# EasyEDA Pro project RCKid.epro, board Devboard
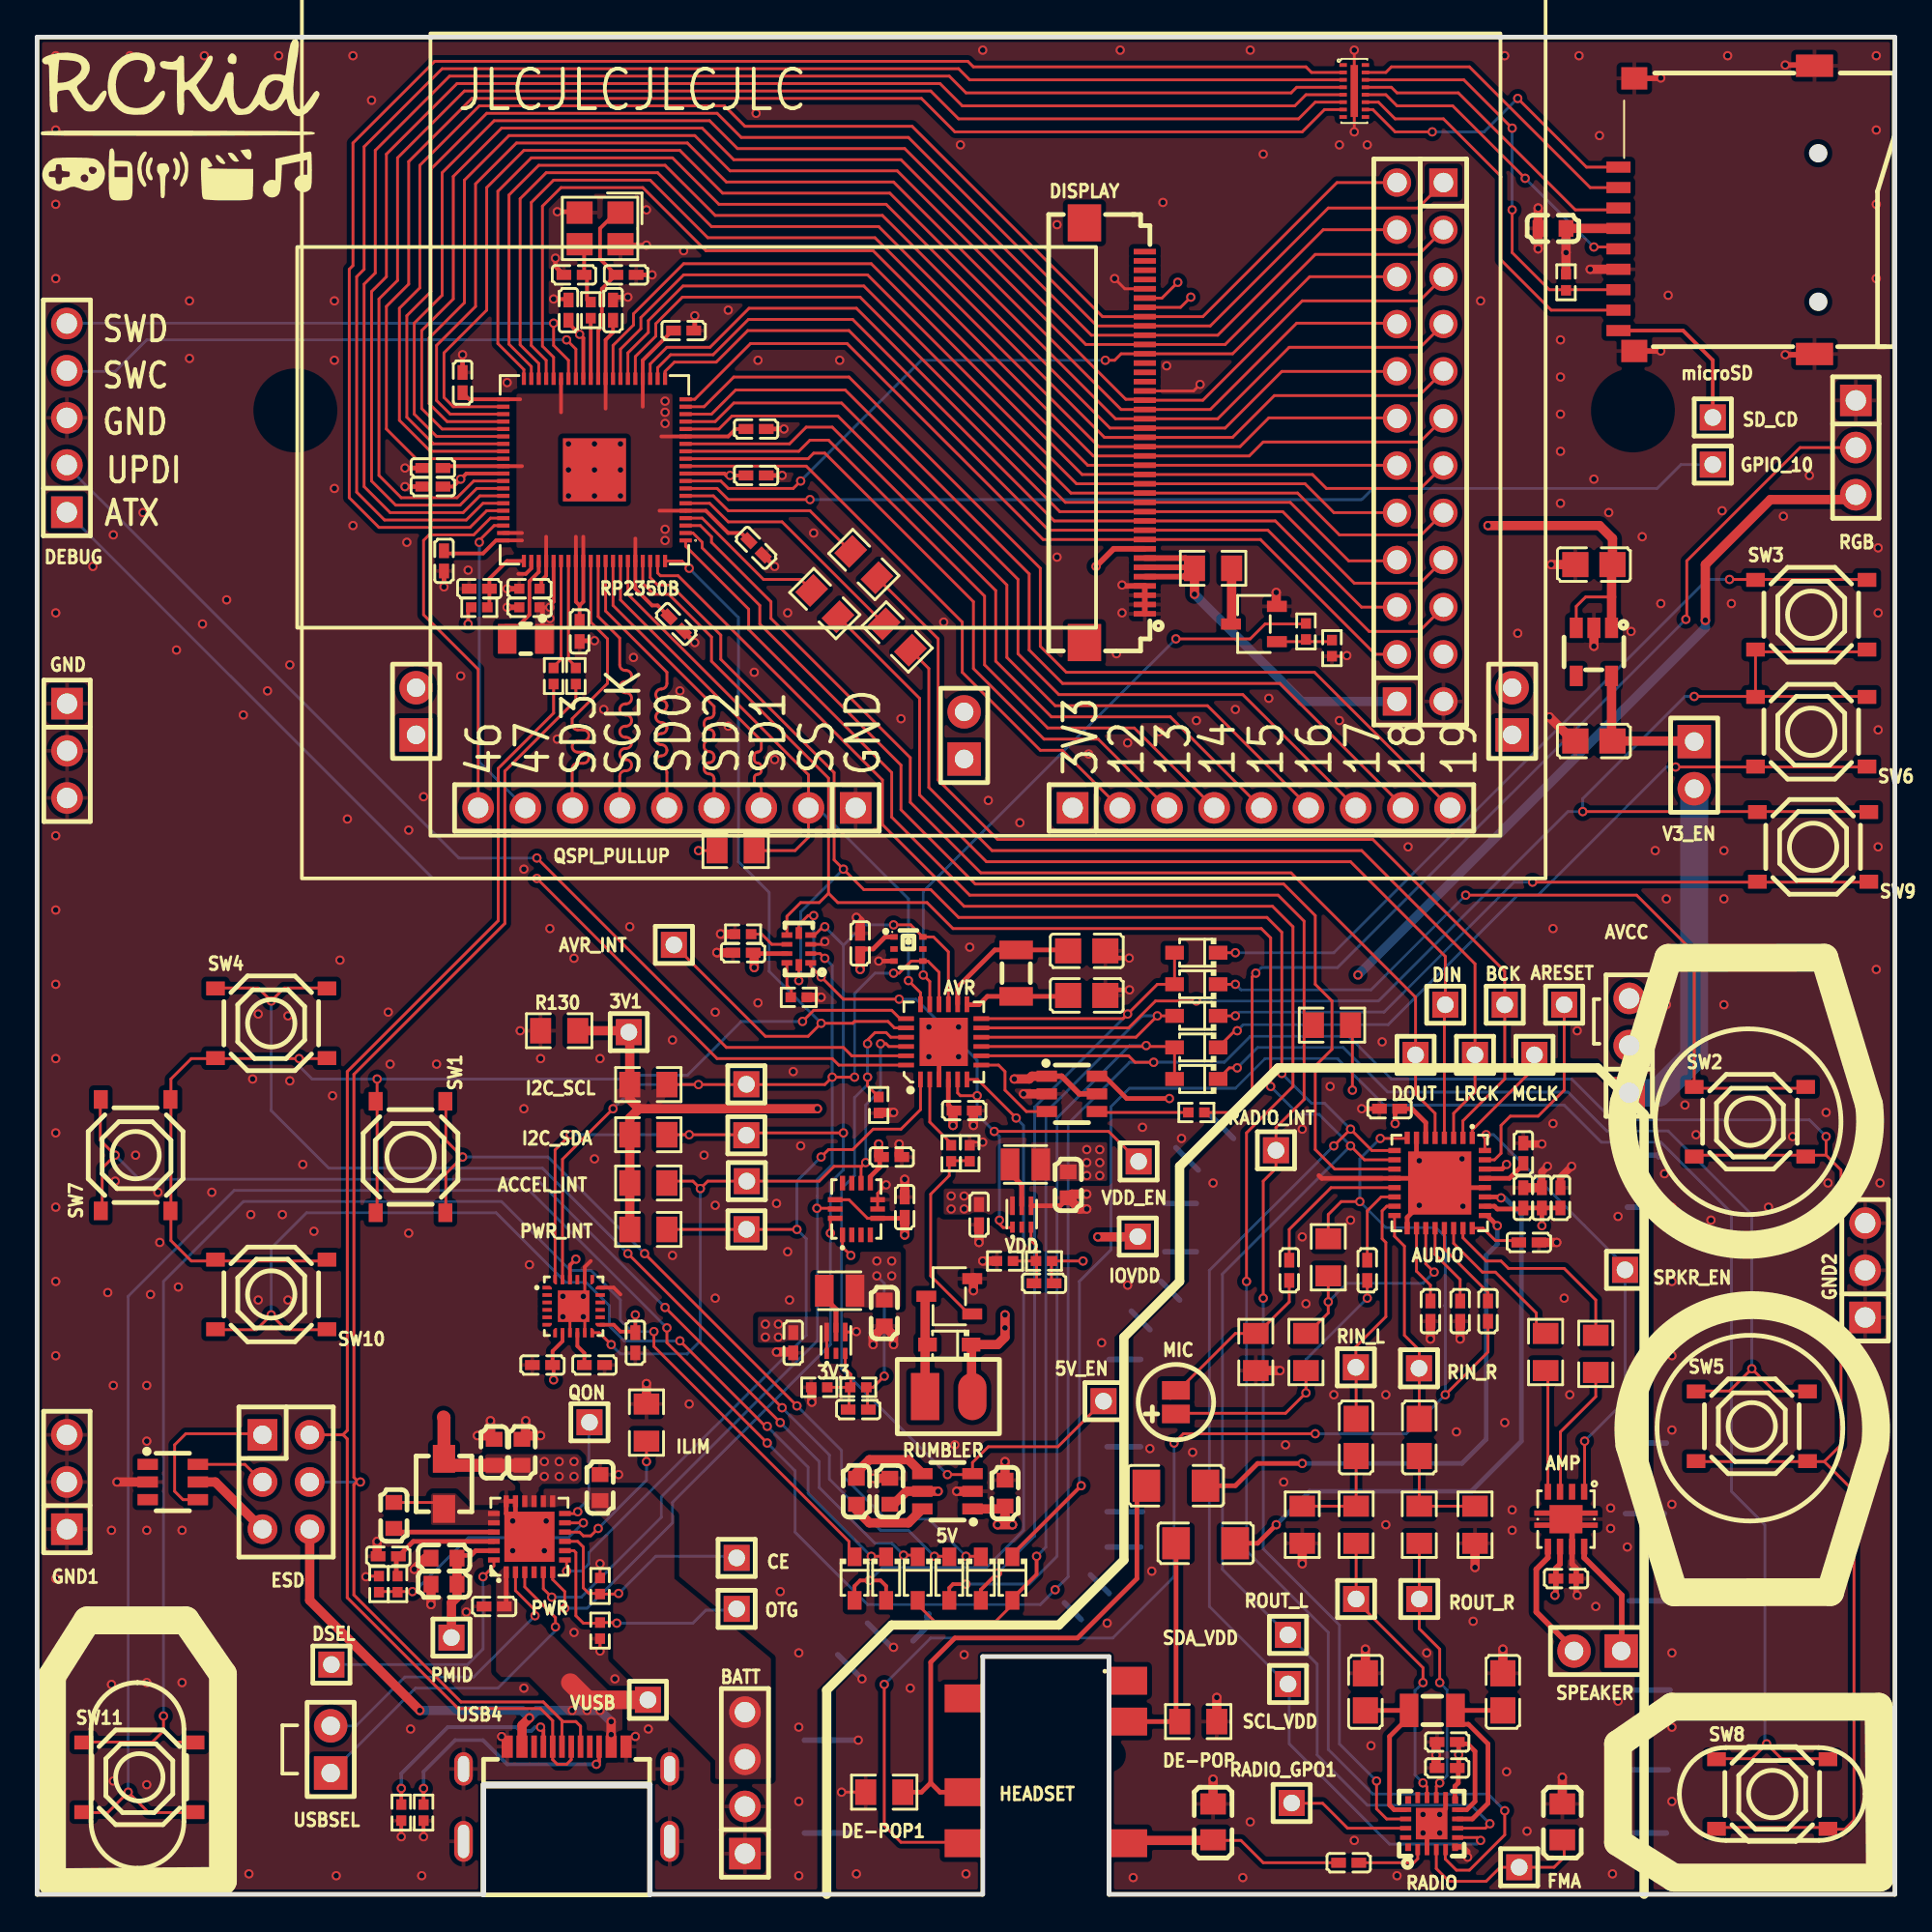
[diagram p23: board, top side]
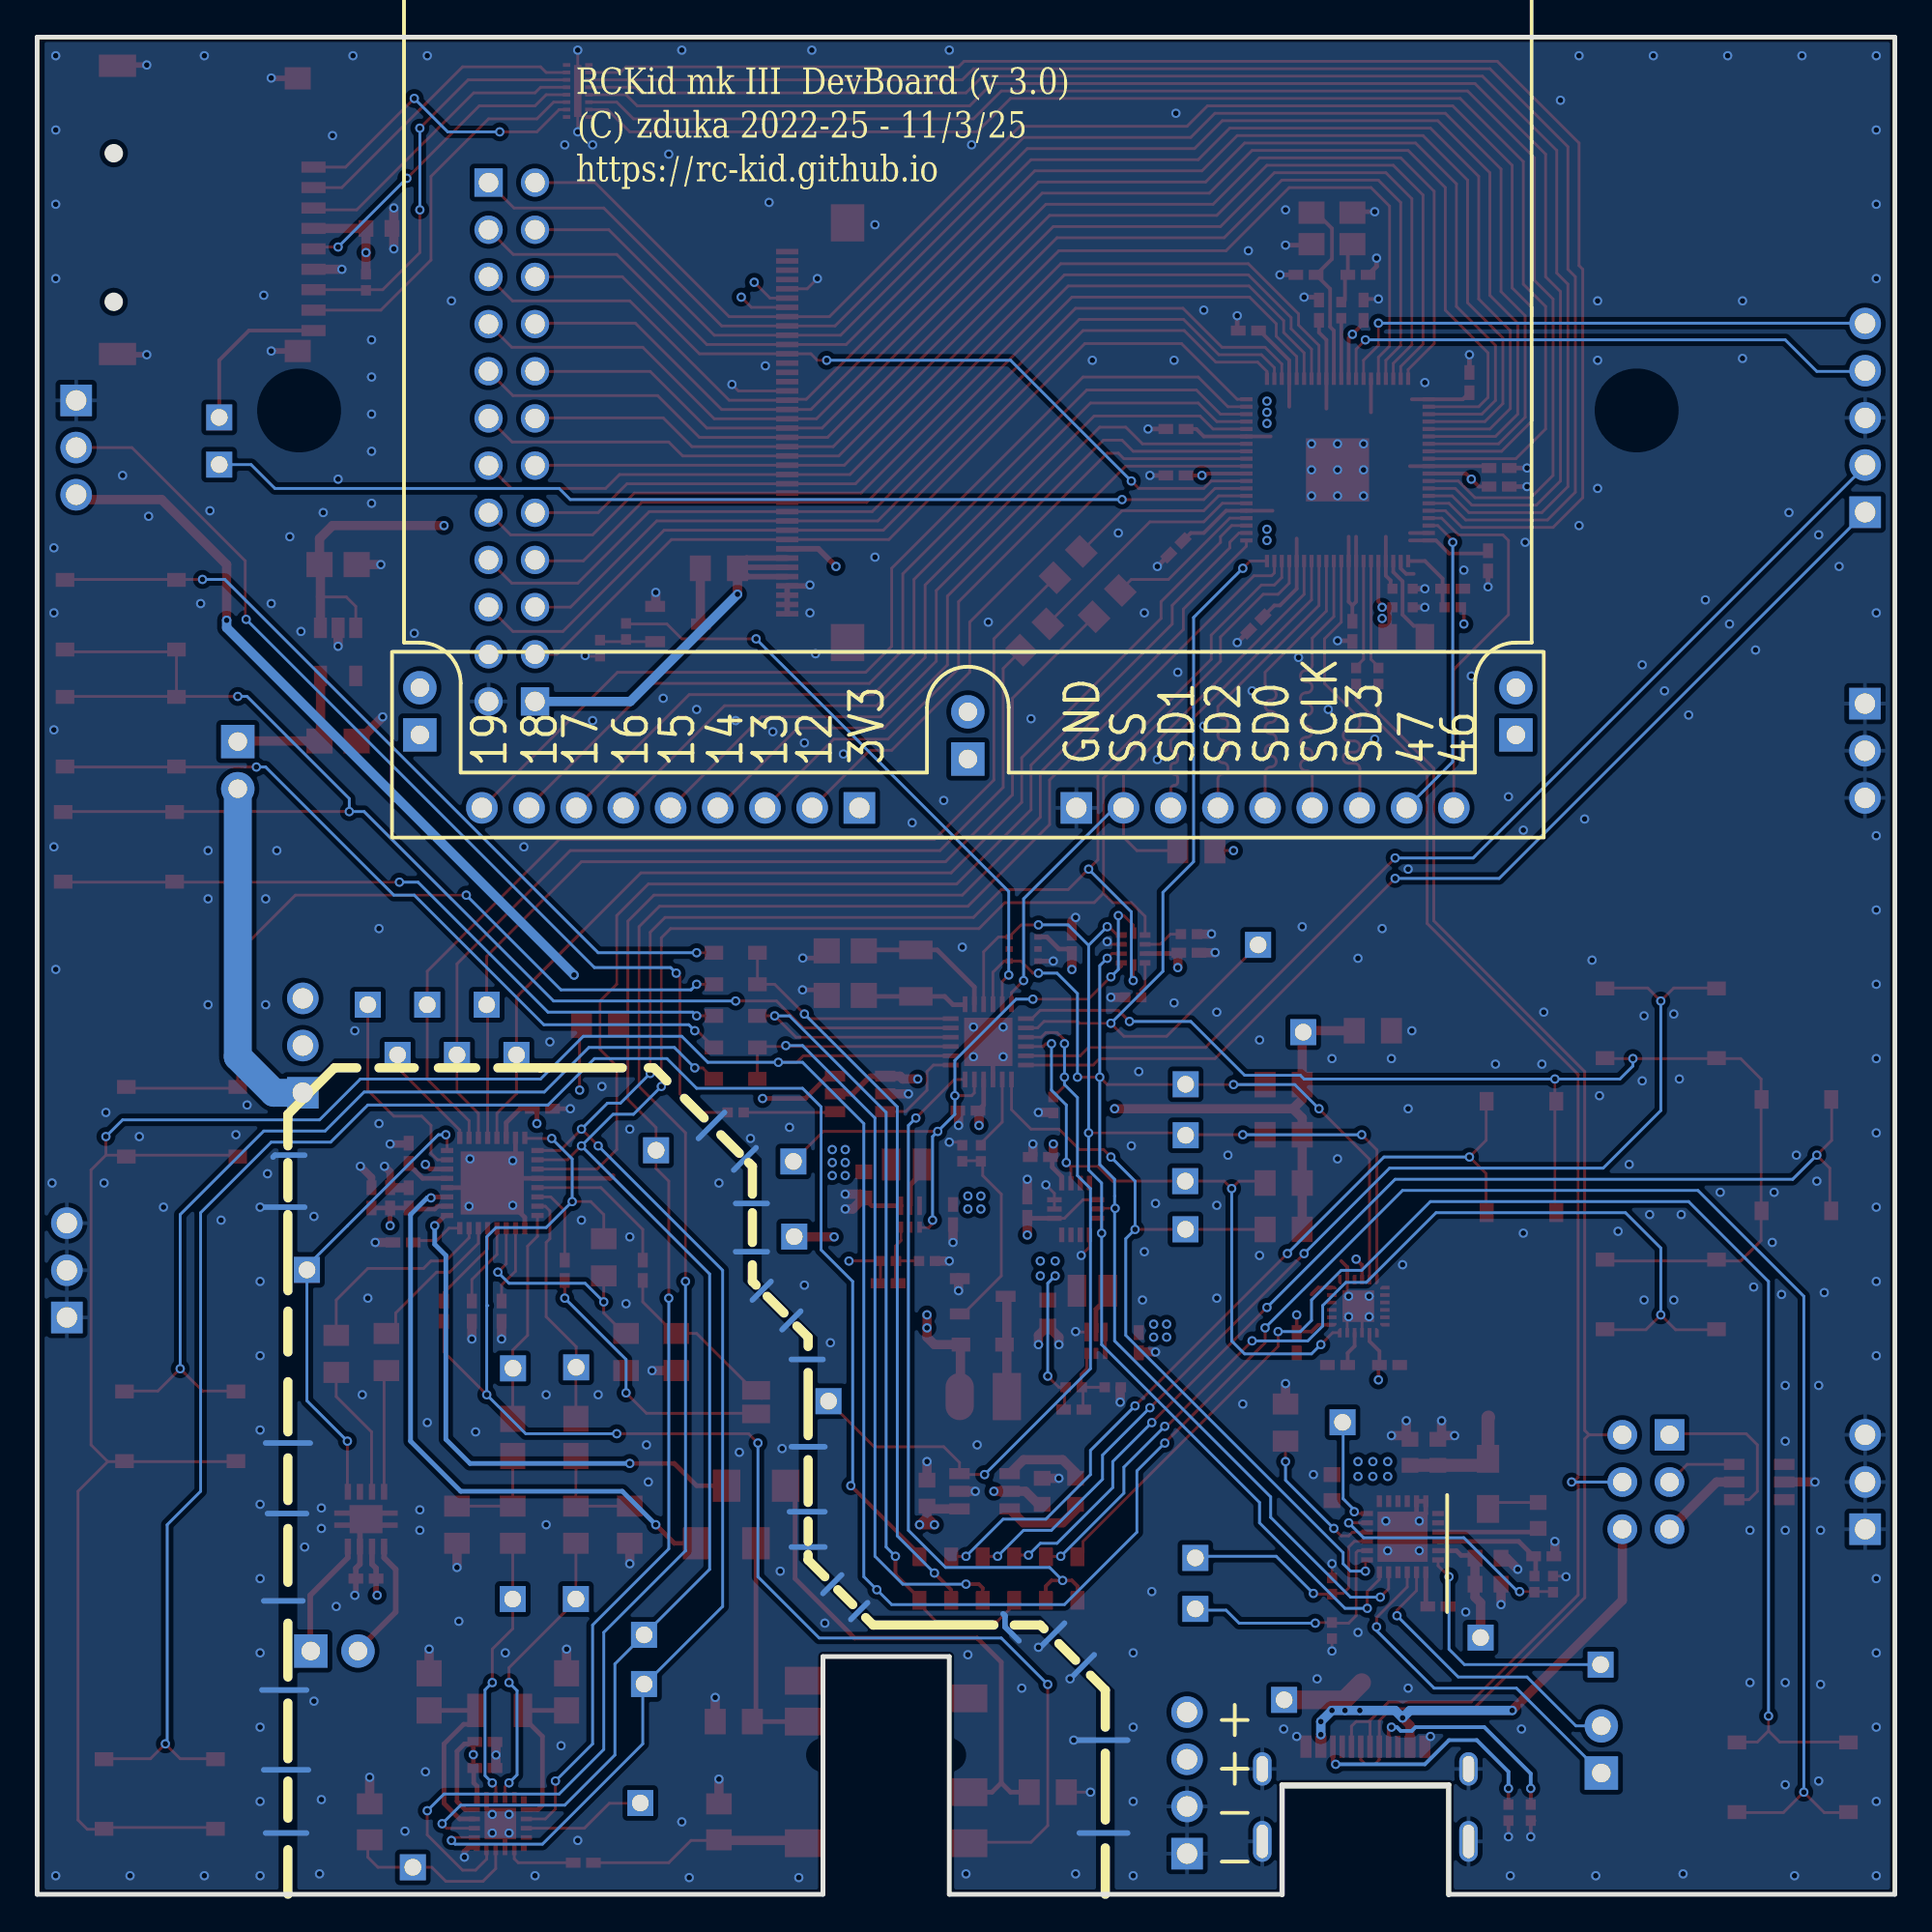
[diagram p24: board, bottom side, seen from below]

Outline 100 x 100.03 mm; copper layers: Top Layer, Inner1, Inner2, Bottom Layer. Coordinates in mm from the lower left corner of the outline.
Outline path: 0,100.03 0,0.03 24,0.03 24,5.93 33,5.93 33,0.03 50.9,0.03 50.9,12.83 57.7,12.83 57.7,0.03 100,0.03 100,100.03 0,100.03
Stack: Top Layer 0.035mm / Dielectric1 0.28mm PP er 4.5 / Inner1 0.035mm / Dielectric2 0.28mm FR4 er 4.5 / Inner2 0.035mm / Dielectric3 0.28mm PP er 4.5 / Bottom Layer 0.035mm

## Design rules (mm)
net USB_DM: DP1
net USB_DP: DP1
template: Custom Config
spacing copperThickness1oz (default): track to track 0.102, other pairs 0.152 to 0.3
spacing copperThickness2oz: track to track 0.203, other pairs 0.152 to 0.3
track width copperThickness1oz (default): min 0.127, default 0.254, max 2.54
track width copperThickness2oz: min 0.203, default 0.254, max 2.54
differential pair differentialPair (default): width min 0.156, default 0.156, max 0.156; gap min 0.2, default 0.2
via viaSize (default): diameter min 0.5, default 0.61, max 10; hole min 0.3, default 0.305, max 6.3
net 3V3 uses copperRegion1
net VUSB uses copperRegion1
net 5V uses copperRegion1
net VCC uses copperRegion1
net DVDD uses copperRegion1
net $1N63472 uses copperRegion1
net VBATT uses copperRegion1
pour e832 uses copperRegion1

## Placement (name value [footprint] x y rotation side)
3V1  -  [HDR-TH_1P-V-M_XKB_X4611WV-01I-C28D40]  31.85 46.45 0 top
3V3  TPS62825DMQT  [VSON-6_L1.5-W1.5-P0.50-TL]  43 29.73 90 top
5V  HX4002-MFC  [SOT-23-6_L2.9-W1.6-P0.95-LS2.8-BR]  49 21.73 0 top
5V_EN  -  [HDR-TH_1P-V-M_XKB_X4611WV-01I-C28D40]  57.4 26.58 0 top
ACCEL_INT  -  [HDR-TH_1P-V-M_XKB_X4611WV-01I-C28D40]  38.2 38.43 0 top
AMP  TPA2006D1DRBR  [VSON-8_L3.0-W3.0-P0.65-TL-EP]  82.3 20.23 270 top
ARESET  -  [HDR-TH_1P-V-M_XKB_X4611WV-01I-C28D40]  82.2 47.93 0 top
AUDIO  TLV320AIC3204IRHBR  [QFN-32_L5.0-W5.0-P0.50-TL-EP3.4]  75.5 38.33 270 top
AVCC  -  [HDR-TH_3P-P2.54-V-M]  85.7 45.73 90 top
AVR  ATTINY3217-MFR  [WQFN-24_L4.0-W4.0-P0.50-TL-EP2.6]  48.8 45.93 90 top
AVR_INT  -  [HDR-TH_1P-V-M_XKB_X4611WV-01I-C28D40]  34.28 51.15 0 top
BATT  -  [HDR-TH_4P-P2.54-V-M]  38.1 6.03 90 top
BCK  -  [HDR-TH_1P-V-M_XKB_X4611WV-01I-C28D40]  79 47.93 0 top
C81  10uF  [C0603]  45.9 21.73 270 top
C82  10uF  [C0603]  52.1 21.63 270 top
C83  2.2uF  [C0603]  44.1 21.73 270 top
C95  100nF  [C0402#2]  46.7 37.03 270 top
C96  100nF  [C0402#2]  46 39.73 180 top
C107  100nF  [C0402#2]  38.7 72.53 135 top
C108  100nF  [C0402#2]  34.4 68.43 135 top
C109  100nF  [C0402#2]  34.8 84.23 180 top
C110  100nF  [C0402#2]  21.3 76.83 0 top
C111  100nF  [C0402#2]  22.9 81.43 270 top
C112  100nF  [C0402#2]  38.7 78.93 180 top
C114  100nF  [C0402#2]  21.3 75.83 0 top
C115  1uF  [C0402#2]  38.7 76.43 180 top
C116  1uF  [C0402#2]  21.9 71.83 90 top
C117  100nF  [C0402#2]  31 85.33 270 top
C118  100nF  [C0402#2]  49.9 42.23 180 top
C132  22uF  [C0603]  81.6 89.73 0 top
C153  15pF  [C0402#2]  31.7 87.23 0 top
C154  15pF  [C0402#2]  28.9 87.23 180 top
C167  100nF  [C0402#2]  29.2 68.03 90 top
C191  100nF  [C0402#2]  80 37.53 270 top
C192  1uF  [C0402#2]  81 37.53 270 top
C199  47uF  [C1206]  61.3 22.03 0 top
C200  47uF  [C1206]  62.9 18.93 0 top
C201  10uF  [C0402#2]  75 31.43 270 top
C202  10uF  [C0402#2]  80.3 35.13 0 top
C203  10uF  [C0402#2]  80 39.93 90 top
C204  10uF  [C0402#2]  82 37.53 90 top
C205  100nF  [C0402#2]  71.6 33.63 270 top
C206  100nF  [C0402#2]  67.4 33.63 270 top
C207  100nF  [C0402#2]  78.1 31.43 270 top
C208  1uF  [C0402#2]  82.3 17.03 180 top
C209  1uF  [C0402#2]  72.8 42.33 0 top
C210  4.7uF  [C0402#2]  28.6 85.33 270 top
C211  4.7uF  [C0402]  26.5 70.33 0 top
C212  4.7uF  [C0402]  26.5 69.33 0 top
C213  4.7uF  [C0402#2]  23.8 70.33 0 top
C214  4.7uF  [C0402#2]  18.9 18.23 0 top
C215  22uF  [C0603]  21.9 18.13 0 top
C216  22uF  [C0603]  21.9 16.73 0 top
C218  1uF  [C0402#2]  24.6 15.53 0 top
C219  10uF  [C0603]  24.6 23.83 270 top
C220  10uF  [C0603]  26.1 23.83 270 top
C221  10uF  [C0603]  30.3 21.93 270 top
C224  4.7uF  [C0402#2]  40.7 29.73 90 top
C225  4.7uF  [C0402#2]  50.7 36.63 90 top
C228  22uF  [C0603]  45.6 31.33 90 top
C229  22uF  [C0603]  55.5 38.23 90 top
C230  120pF  [C0402#2]  44.2 26.13 0 top
C231  120pF  [C0402#2]  54.2 32.93 0 top
C232  22pF  [C0805]  56.5 48.43 180 top
C233  22pF  [C0805]  56.5 50.83 180 top
C234  100nF  [C0402#2]  38 50.73 0 top
C235  100nF  [C0402#2]  44.3 51.23 270 top
C236  22nF  [C0402#2]  75.9 6.83 0 top
C237  100nF  [C0402#2]  75.9 8.23 180 top
C238  22pF  [C0805]  78.9 10.93 90 top
C239  22pF  [C0805]  71.5 10.93 270 top
C240  470nF  [C0805]  71 24.63 90 top
C241  470nF  [C0805]  74.4 24.63 90 top
C242  100pF  [C0402#2]  70.6 1.73 0 top
C243  47nF  [C0603]  19.2 20.43 90 top
C244  100nF  [C0402#2]  76.6 31.43 90 top
C245  1uF  [C0805]  83.8 71.63 0 top
C246  1uF  [C0805]  83.8 62.13 0 top
C247  100nF  [C0402#2]  32.2 29.73 90 top
C248  100nF  [C0402#2]  30 28.53 180 top
C249  10nF  [C0402#2]  27.2 28.53 0 top
CE  -  [HDR-TH_1P-V-M_XKB_X4611WV-01I-C28D40]  37.65 18.14 0 top
D4  1N5819WS  [SOD-323_L1.8-W1.3-LS2.5-RD]  49.1 29.63 180 top
D5  1N5819WS  [SOD-323_L1.8-W1.3-LS2.5-RD]  50.8 17.03 270 top
D6  1N5819WS  [SOD-323_L1.8-W1.3-LS2.5-RD]  49.1 17.03 270 top
D7  1N5819WS  [SOD-323_L1.8-W1.3-LS2.5-RD]  47.4 17.03 270 top
D8  1N5819WS  [SOD-323_L1.8-W1.3-LS2.5-RD]  45.7 17.03 270 top
D9  1N5819WS  [SOD-323_L1.8-W1.3-LS2.5-RD]  62.4 49.03 180 top
D10  1N5819WS  [SOD-323_L1.8-W1.3-LS2.5-RD]  62.4 43.93 180 top
D11  1N5819WS  [SOD-323_L1.8-W1.3-LS2.5-RD]  52.5 17.03 270 top
D12  1N5819WS  [SOD-323_L1.8-W1.3-LS2.5-RD]  44 17.03 270 top
D14  1N5819WS  [SOD-323_L1.8-W1.3-LS2.5-RD]  62.4 45.63 180 top
D15  1N5819WS  [SOD-323_L1.8-W1.3-LS2.5-RD]  62.4 47.33 180 top
D17  1N5819WS  [SOD-323_L1.8-W1.3-LS2.5-RD]  62.4 50.73 180 top
DE-POP  100kΩ  [R0805]  62.5 9.33 180 top
DE-POP1  100kΩ  [R0805]  45.6 5.53 0 top
DEBUG  -  [HDR-TH_5P-P2.54-V-M]  1.6 79.53 90 top
DIN  -  [HDR-TH_1P-V-M_XKB_X4611WV-01I-C28D40]  75.8 47.93 0 top
DISPLAY  FPC-05FB-40PH20  [FPC-SMD_40P-P0.50_XUNPU_FPC-05FB-40PH20]  58 78.73 270 top
DOUT  -  [HDR-TH_1P-V-M_XKB_X4611WV-01I-C28D40]  74.2 45.23 0 top
DSEL  -  [HDR-TH_1P-V-M_XKB_X4611WV-01I-C28D40]  15.84 12.4 0 top
ESD  -  [HDR-TH_6P-P2.54-V-F-R2-C3-S2.54]  13.4 22.23 270 top
FMA  -  [HDR-TH_1P-V-M_XKB_X4611WV-01I-C28D40]  79.78 1.49 0 top
GND  -  [HDR-TH_3P-P2.54-V-M]  1.61 61.6 270 top
GND1  -  [HDR-TH_3P-P2.54-V-M]  1.6 22.23 90 top
GND2  -  [HDR-TH_3P-P2.54-V-M]  98.4 33.63 90 top
GPIO_10  -  [HDR-TH_1P-V-M_XKB_X4611WV-01I-C28D40]  90.2 77.01 0 top
H1  -  [HDR-TH_12P-P2.54-V-M]  73.2 78.23 90 top
H2  -  [HDR-TH_12P-P2.54-V-M]  75.7 78.23 270 top
H4  -  [HDR-TH_2P-P2.54-V-M-1]  49.9 62.43 90 top
H5  -  [HDR-TH_2P-P2.54-V-M-1]  20.4 63.73 90 top
H6  -  [HDR-TH_2P-P2.54-V-M-1]  79.4 63.73 90 top
H7  -  [HDR-TH_9P-P2.54-V-M]  33.9 58.53 180 top
H8  -  [HDR-TH_9P-P2.54-V-M]  65.9 58.53 0 top
HEADSET  PJ-342D  [AUDIO-SMD_PJ-342D]  54.3 0.03 90 top
I2C_SCL  -  [HDR-TH_1P-V-M_XKB_X4611WV-01I-C28D40]  38.18 43.65 0 top
I2C_SDA  -  [HDR-TH_1P-V-M_XKB_X4611WV-01I-C28D40]  38.18 40.9 0 top
ILIM  270Ω  [R0805]  32.8 25.43 90 top
IOVDD  -  [HDR-TH_1P-V-M_XKB_X4611WV-01I-C28D40]  59.25 35.45 0 top
L15  IP4252CZ16-8-TTL,1  [UDFN-16_L3.3-W1.4-P0.40-BL-EP]  70.9 97.13 270 top
L16  AOTA-B201610S3R3-101-T  [IND-SMD_L2.0-W1.6_AOTA-B201610S3R3-101-T]  26.3 67.63 0 top
L17  2.2uH  [IND-SMD_L3.0-W3.0_IHLP-1212BZ]  21.9 22.13 90 top
L18  270nH  [L0805]  63.3 3.93 90 top
L19  120nH  [L0805]  82.1 3.93 90 top
LRCK  -  [HDR-TH_1P-V-M_XKB_X4611WV-01I-C28D40]  77.4 45.23 0 top
MCLK  -  [HDR-TH_1P-V-M_XKB_X4611WV-01I-C28D40]  80.6 45.23 0 top
MIC  GMI4015-2C-56db  [MIC-SMD_BD4.0_GMI4015-2C-32DB]  61.3 26.53 90 top
microSD  TF-01A  [TF-SMD_TF-01A]  90.4 90.73 90 top
OTG  -  [HDR-TH_1P-V-M_XKB_X4611WV-01I-C28D40]  37.65 15.4 0 top
PMID  -  [HDR-TH_1P-V-M_XKB_X4611WV-01I-C28D40]  22.3 13.85 0 top
PWR  -  [QFN-24_L4.0-W4.0-P0.50-TL-EP2.7]  26.5 19.28 90 top
PWR_INT  -  [HDR-TH_1P-V-M_XKB_X4611WV-01I-C28D40]  38.19 35.84 0 top
Q6  AO3400A  [SOT-23-3_L2.9-W1.6-P1.90-LS2.8-BR]  65.5 68.43 0 top
Q9  AO3400A  [SOT-23-3_L2.9-W1.6-P1.90-LS2.8-BR]  49.1 32.23 0 top
QON  -  [HDR-TH_1P-V-M_XKB_X4611WV-01I-C28D40]  29.73 25.45 0 top
QSPI_PULLUP  10kΩ  [R0805]  37.6 56.23 180 top
R45  2.2kΩ  [R0805]  32.9 43.63 180 top
R46  2.2kΩ  [R0805]  32.9 40.93 180 top
R48  10kΩ  [R0402]  45.3 42.53 270 top
R50  22Ω  [R0402]  27.8 65.63 90 top
R51  22Ω  [R0402]  29 65.63 90 top
R54  10kΩ  [R0402]  50.2 39.93 90 top
R55  10kΩ  [R0402]  69.7 67.13 270 top
R57  5.1kΩ  [R0402]  20.8 4.43 270 top
R58  5.1kΩ  [R0402]  19.6 4.43 270 top
R76  10kΩ  [R0402]  82.3 86.83 270 top
R84  5.1Ω  [R0805]  63.3 71.43 0 top
R87  470Ω  [R0402]  62.4 42.13 0 top
R91  1kΩ  [R0402]  49.2 39.93 90 top
R92  1kΩ  [R0402]  68.3 68.03 90 top
R93  1kΩ  [R0402]  29.8 85.33 90 top
R103  1kΩ  [R0805]  68.3 29.23 90 top
R104  1kΩ  [R0805]  65.6 29.23 90 top
R105  220kΩ  [R0805]  81.2 29.23 270 top
R106  220kΩ  [R0805]  83.9 29.13 270 top
R109  33Ω  [R0402]  23.8 69.33 0 top
R110  10kΩ  [R0402]  30.3 16.63 90 top
R111  10kΩ  [R0402]  30.3 14.23 270 top
R112  10kΩ  [R0402]  19.4 16.73 270 top
R113  10kΩ  [R0402]  18.4 16.73 90 top
R115  100kΩ  [R0402]  42.1 27.33 0 top
R116  100kΩ  [R0402]  52.1 34.13 0 top
R117  450kΩ  [R0402]  44.2 27.33 0 top
R118  450kΩ  [R0402]  54.2 34.13 0 top
R119  10kΩ  [R0402]  41 48.33 0 top
R120  10kΩ  [R0402]  38 51.73 180 top
R121  10kΩ  [R0805]  77.4 19.93 270 top
R122  10kΩ  [R0805]  68.1 19.93 270 top
R123  2.7kΩ  [R0805]  69.5 34.33 270 top
R128  10kΩ  [R0805]  32.9 35.83 180 top
R129  10kΩ  [R0805]  32.9 38.33 180 top
R130  100kΩ  [R0805]  28.1 46.53 0 top
R131  10kΩ  [R0805]  69.7 46.83 0 top
R132  0Ω  [R0805]  71 19.93 90 top
R133  0Ω  [R0805]  74.4 19.93 90 top
R134  0Ω  [R0805]  42.4 69.53 315 top
R135  0Ω  [R0805]  46.3 67.73 315 top
R136  0Ω  [R0805]  44.5 71.63 315 top
RADIO  SI4705-D60-GM  [QFN-20_L3.0-W3.0-P0.50-TL-EP1.7_SILICON-LABS_SI47XX]  75.07 3.84 90 top
RADIO_GPO1  -  [HDR-TH_1P-V-M_XKB_X4611WV-01I-C28D40]  67.53 4.95 0 top
RADIO_INT  -  [HDR-TH_1P-V-M_XKB_X4611WV-01I-C28D40]  66.69 40.09 0 top
RGB  -  [HDR-TH_3P-P2.54-V-M]  97.9 77.93 270 top
RIN_L  -  [HDR-TH_1P-V-M_XKB_X4611WV-01I-C28D40]  70.99 28.41 0 top
RIN_R  -  [HDR-TH_1P-V-M_XKB_X4611WV-01I-C28D40]  74.39 28.35 0 top
ROUT_L  -  [HDR-TH_1P-V-M_XKB_X4611WV-01I-C28D40]  71 15.93 0 top
ROUT_R  -  [HDR-TH_1P-V-M_XKB_X4611WV-01I-C28D40]  74.4 15.93 0 top
RP2350B  RP2350B  [QFN-80_L10.0-W10.0-P0.40-TL-EP3.4]  30 76.73 180 top
RUMBLER  -  [SMT wire pad (2)]  47.8 26.83 90 top
SCL_VDD  -  [HDR-TH_1P-V-M_XKB_X4611WV-01I-C28D40]  67.33 11.35 0 top
SD_CD  -  [HDR-TH_1P-V-M_XKB_X4611WV-01I-C28D40]  90.2 79.55 0 top
SDA_VDD  -  [HDR-TH_1P-V-M_XKB_X4611WV-01I-C28D40]  67.33 14 0 top
SPEAKER  -  [HDR-TH_2P-P2.54-V-M-1]  84 13.13 180 top
SPKR_EN  -  [HDR-TH_1P-V-M_XKB_X4611WV-01I-C28D40]  85.48 33.65 0 top
SW1  TS-1187A-B-A-B  [SW-SMD_4P-L5.1-W5.1-P3.70-LS6.5-TL_H1.5]  20.1 39.73 270 top
SW2  TS-1187A-B-A-B  [SW-SMD_4P-L5.1-W5.1-P3.70-LS6.5-TL_H1.5]  92.2 41.63 0 top
SW3  TS-1187A-B-A-B  [SW-SMD_4P-L5.1-W5.1-P3.70-LS6.5-TL_H1.5]  95.5 68.93 0 top
SW4  TS-1187A-B-A-B  [SW-SMD_4P-L5.1-W5.1-P3.70-LS6.5-TL_H1.5]  12.6 46.93 0 top
SW5  TS-1187A-B-A-B  [SW-SMD_4P-L5.1-W5.1-P3.70-LS6.5-TL_H1.5]  92.3 25.23 0 top
SW6  TS-1187A-B-A-B  [SW-SMD_4P-L5.1-W5.1-P3.70-LS6.5-TL_H1.5]  95.5 62.63 180 top
SW7  TS-1187A-B-A-B  [SW-SMD_4P-L5.1-W5.1-P3.70-LS6.5-TL_H1.5]  5.3 39.83 90 top
SW8  TS-1187A-B-A-B  [SW-SMD_4P-L5.1-W5.1-P3.70-LS6.5-TL_H1.5]  93.4 5.43 0 top
SW9  TS-1187A-B-A-B  [SW-SMD_4P-L5.1-W5.1-P3.70-LS6.5-TL_H1.5]  95.6 56.43 180 top
SW10  TS-1187A-B-A-B  [SW-SMD_4P-L5.1-W5.1-P3.70-LS6.5-TL_H1.5]  12.6 32.33 180 top
SW11  TS-1187A-B-A-B  [SW-SMD_4P-L5.1-W5.1-P3.70-LS6.5-TL_H1.5]  5.5 6.33 0 top
TV1  SRV05-4-P-T7  [SOT-23-6_L2.9-W1.6-P0.95-LS2.8-BR]  7.3 22.23 180 top
U26  BMI160  [LGA-14_L3.0-W2.5-P0.50-BL]  44.1 36.93 0 top
U33  SN74LVC1T45DBVR  [SOT-23-6_L2.9-W1.6-P0.95-LS2.8-BR]  55.7 43.13 180 top
U39  ABM8-272-T3  [CRYSTAL-SMD_4P-L3.2-W2.5-BL]  30.3 89.73 180 top
U40  TS5A23159RSER  [UQFN-10_L2.0-W1.5-P0.50-BL-EP]  41 50.93 90 top
U41  LTR-390UV-01  [SENSOR-SMD_LTR-390UV-01]  46.9 50.93 270 top
U42  -  [TSOT-23-5_L2.9-W1.6-P0.95-LS2.8-BR]  83.8 66.93 90 top
U43  MPU-6500  [QFN-24_L3.0-W3.0-P0.40-BL-EP]  28.88 31.7 270 top
USB1  470nH  [IND-SMD_L2.0-W1.6]  43.2 32.53 180 top
USB2  470nH  [IND-SMD_L2.0-W1.6]  53.2 39.33 180 top
USB4  GT-USB-9014AB  [USB-C-SMD_GT-USB-9014AB]  28.5 5.43 0 top
USBSEL  -  [HDR-TH_2P-P2.54-V-M-1]  15.8 7.83 90 top
V3_EN  -  [HDR-TH_2P-P2.54-V-M-1]  89.2 60.83 270 top
VDD  TPS62825DMQT  [VSON-6_L1.5-W1.5-P0.50-TL]  53 36.53 90 top
VDD_EN  -  [HDR-TH_1P-V-M_XKB_X4611WV-01I-C28D40]  59.29 39.49 0 top
VUSB  -  [HDR-TH_1P-V-M_XKB_X4611WV-01I-C28D40]  32.88 10.5 0 top
X1  32.768kHz  [FC-135R_L3.2-W1.5]  52.7 49.63 90 top
X2  32.768kHz  [FC-135R_L3.2-W1.5]  75.1 9.93 180 top

## Footprints (pads in the part's own frame, mm; a bottom-side part is the same pattern mirrored in y, then rotated)
AUDIO-SMD_PJ-342D
  rect 1.5x2 smd: 1(2.75,-4.45) 2(2.75,4.45) 3(9.3,-4.45) 4(5.5,4.45) 5(10.55,4.45) 6(11.5,-4.45)
C0402
  rect 0.54x0.54 smd: 1(-0.545,0) 2(0.545,0)
C0402#2
  rect 0.79x0.54 smd: 1(-0.545,0) 2(0.545,0)
C0603
  rect 0.8x0.9 smd: 1(-0.7,0) 2(0.7,0)
C0805
  rect 1.41x1.35 smd: 1(-1,0) 2(1,0)
C1206
  rect 1.485x1.728 smd: 1(-1.593,0) 2(1.593,0)
CRYSTAL-SMD_4P-L3.2-W2.5-BL
  rect 1.4x1.2 smd: 1(-1.1,-0.85) 2(1.1,-0.85) 3(1.1,0.85) 4(-1.1,0.85)
FC-135R_L3.2-W1.5
  rect 1x1.8 smd: 1(-1.25,0) 2(1.25,0)
FPC-SMD_40P-P0.50_XUNPU_FPC-05FB-40PH20
  rect 0.3x1.2 smd: 1(9.75,1.625) 2(9.25,1.625) 3(8.75,1.625) 4(8.25,1.625) 5(7.75,1.625) 6(7.25,1.625) 7(6.75,1.625) 8(6.25,1.625) 9(5.75,1.625) 10(5.25,1.625) 11(4.75,1.625) 12(4.25,1.625) 13(3.75,1.625) 14(3.25,1.625) 15(2.75,1.625) 16(2.25,1.625) 17(1.75,1.625) 18(1.25,1.625) 19(0.75,1.625) 20(0.25,1.625) 21(-0.25,1.625) 22(-0.75,1.625) 23(-1.25,1.625) 24(-1.75,1.625) 25(-2.25,1.625) 26(-2.75,1.625) 27(-3.25,1.625) 28(-3.75,1.625) 29(-4.25,1.625) 30(-4.75,1.625) 31(-5.25,1.625) 32(-5.75,1.625) 33(-6.25,1.625) 34(-6.75,1.625) 35(-7.25,1.625) 36(-7.75,1.625) 37(-8.25,1.625) 38(-8.75,1.625) 39(-9.25,1.625) 40(-9.75,1.625)
  rect 2x1.8 smd: 41(-11.3,-1.625) 42(11.3,-1.625)
HDR-TH_1P-V-M_XKB_X4611WV-01I-C28D40
  rect 1.4x1.4 hole 0.9: 1(0,0)
HDR-TH_2P-P2.54-V-M-1
  rect 1.8x1.8 hole 1: 1(-1.27,0)
  round 1.8 hole 1: 2(1.27,0)
HDR-TH_3P-P2.54-V-M
  rect 1.7x1.7 hole 1.1: 1(-2.54,0)
  round 1.7 hole 1.1: 2(0,0) 3(2.54,0)
HDR-TH_4P-P2.54-V-M
  rect 1.7x1.7 hole 1.1: 1(-3.81,0)
  round 1.7 hole 1.1: 2(-1.27,0) 3(1.27,0) 4(3.81,0)
HDR-TH_5P-P2.54-V-M
  rect 1.7x1.7 hole 1.1: 1(-5.08,0)
  round 1.7 hole 1.1: 2(-2.54,0) 3(0,0) 4(2.54,0) 5(5.08,0)
HDR-TH_6P-P2.54-V-F-R2-C3-S2.54
  rect 1.7x1.6 hole 1: 1(-2.54,-1.27)
  round 1.6 hole 1: 2(-2.54,1.27) 3(0,-1.27) 4(0,1.27) 5(2.54,-1.27) 6(2.54,1.27)
HDR-TH_9P-P2.54-V-M
  rect 1.7x1.7 hole 1.1: 1(-10.16,0)
  round 1.7 hole 1.1: 2(-7.62,0) 3(-5.08,0) 4(-2.54,0) 5(0,0) 6(2.54,0) 7(5.08,0) 8(7.62,0) 9(10.16,0)
HDR-TH_12P-P2.54-V-M
  rect 1.524x1.524 hole 1.05: 1(-13.97,0)
  round 1.524 hole 1.05: 2(-11.43,0) 3(-8.89,0) 4(-6.35,0) 5(-3.81,0) 6(-1.27,0) 7(1.27,0) 8(3.81,0) 9(6.35,0) 10(8.89,0) 11(11.43,0) 12(13.97,0)
IND-SMD_L2.0-W1.6
  rect 1x1.72 smd: 1(0.828,0) 2(-0.828,0)
IND-SMD_L2.0-W1.6_AOTA-B201610S3R3-101-T
  rect 1x1.6 smd: 1(-1,0) 2(1,0)
IND-SMD_L3.0-W3.0_IHLP-1212BZ
  rect 1.5x1.2 smd: 1(-1.35,0) 2(1.35,0)
L0805
  rect 1.133x1.377 smd: 1(-0.966,0) 2(0.966,0)
LGA-14_L3.0-W2.5-P0.50-BL
  rect 0.28x0.785 smd: 1(-0.75,-1.393) 2(-0.25,-1.393) 3(0.25,-1.393) 4(0.75,-1.393) 8(0.75,1.393) 9(0.25,1.393) 10(-0.25,1.393) 11(-0.75,1.393)
  rect 0.785x0.28 smd: 5(1.143,-0.5) 6(1.143,0) 7(1.143,0.5) 12(-1.143,0.5) 13(-1.143,0) 14(-1.143,-0.5)
MIC-SMD_BD4.0_GMI4015-2C-32DB
  rect 1x1.5 smd: 1(-0.635,0) 2(0.635,0)
QFN-20_L3.0-W3.0-P0.50-TL-EP1.7_SILICON-LABS_SI47XX
  rect 0.4x0.32 smd: 1(-1.275,1.265) 6(-1.275,-1.265) 11(1.275,-1.265) 16(1.275,1.265)
  rect 0.6x0.25 smd: 2(-1.4,0.75) 3(-1.4,0.25) 4(-1.4,-0.25) 5(-1.4,-0.75) 12(1.4,-0.75) 13(1.4,-0.25) 14(1.4,0.25) 15(1.4,0.75)
  rect 0.25x0.6 smd: 7(-0.75,-1.4) 8(-0.25,-1.4) 9(0.25,-1.4) 10(0.75,-1.4) 17(0.75,1.4) 18(0.25,1.4) 19(-0.25,1.4) 20(-0.75,1.4)
  rect 1.7x1.7 smd: 21(0,0)
QFN-24_L3.0-W3.0-P0.40-BL-EP
  custom 0.2x0.506 smd: 1(-1,-1.427) 6(1,-1.427) 13(1,1.427) 18(-1,1.427)
  rect 0.2x0.505 smd: 2(-0.6,-1.427) 3(-0.2,-1.427) 4(0.2,-1.427) 5(0.6,-1.427) 14(0.6,1.427) 15(0.2,1.427) 16(-0.2,1.427) 17(-0.6,1.427)
  custom 0.506x0.2 smd: 7(1.427,-1) 12(1.427,1) 19(-1.427,1) 24(-1.427,-1)
  rect 0.505x0.2 smd: 8(1.427,-0.6) 9(1.427,-0.2) 10(1.427,0.2) 11(1.427,0.6) 20(-1.427,0.6) 21(-1.427,0.2) 22(-1.427,-0.2) 23(-1.427,-0.6)
  rect 1.7x1.7 smd: 25(0,0)
QFN-24_L4.0-W4.0-P0.50-TL-EP2.7
  rect 0.633x0.28 smd: 1(-1.911,1.25) 2(-1.911,0.75) 3(-1.911,0.25) 4(-1.911,-0.25) 5(-1.911,-0.75) 6(-1.911,-1.25) 13(1.911,-1.25) 14(1.911,-0.75) 15(1.911,-0.25) 16(1.911,0.25) 17(1.911,0.75) 18(1.911,1.25)
  rect 0.28x0.633 smd: 7(-1.25,-1.911) 8(-0.75,-1.911) 9(-0.25,-1.911) 10(0.25,-1.911) 11(0.75,-1.911) 12(1.25,-1.911) 19(1.25,1.911) 20(0.75,1.911) 21(0.25,1.911) 22(-0.25,1.911) 23(-0.75,1.911) 24(-1.25,1.911)
  rect 2.7x2.7 smd: 25(0,0)
QFN-32_L5.0-W5.0-P0.50-TL-EP3.4
  rect 0.665x0.28 smd: 1(-2.433,1.75) 2(-2.433,1.25) 3(-2.433,0.75) 4(-2.433,0.25) 5(-2.433,-0.25) 6(-2.433,-0.75) 7(-2.433,-1.25) 8(-2.433,-1.75) 17(2.433,-1.75) 18(2.433,-1.25) 19(2.433,-0.75) 20(2.433,-0.25) 21(2.433,0.25) 22(2.433,0.75) 23(2.433,1.25) 24(2.433,1.75)
  rect 0.28x0.665 smd: 9(-1.75,-2.433) 10(-1.25,-2.433) 11(-0.75,-2.433) 12(-0.25,-2.433) 13(0.25,-2.433) 14(0.75,-2.433) 15(1.25,-2.433) 16(1.75,-2.433) 25(1.75,2.433) 26(1.25,2.433) 27(0.75,2.433) 28(0.25,2.433) 29(-0.25,2.433) 30(-0.75,2.433) 31(-1.25,2.433) 32(-1.75,2.433)
  rect 3.4x3.4 smd: 33(0,0)
QFN-80_L10.0-W10.0-P0.40-TL-EP3.4
  rect 0.665x0.22 smd: 1(-4.907,3.8) 2(-4.907,3.4) 3(-4.907,3) 4(-4.907,2.6) 5(-4.907,2.2) 6(-4.907,1.8) 7(-4.907,1.4) 8(-4.907,1) 9(-4.907,0.6) 10(-4.907,0.2) 11(-4.907,-0.2) 12(-4.907,-0.6) 13(-4.907,-1) 14(-4.907,-1.4) 15(-4.907,-1.8) 16(-4.907,-2.2) 17(-4.907,-2.6) 18(-4.907,-3) 19(-4.907,-3.4) 20(-4.907,-3.8) 41(4.907,-3.8) 42(4.907,-3.4) 43(4.907,-3) 44(4.907,-2.6) 45(4.907,-2.2) 46(4.907,-1.8) 47(4.907,-1.4) 48(4.907,-1) 49(4.907,-0.6) 50(4.907,-0.2) 51(4.907,0.2) 52(4.907,0.6) 53(4.907,1) 54(4.907,1.4) 55(4.907,1.8) 56(4.907,2.2) 57(4.907,2.6) 58(4.907,3) 59(4.907,3.4) 60(4.907,3.8)
  rect 0.22x0.665 smd: 21(-3.8,-4.907) 22(-3.4,-4.907) 23(-3,-4.907) 24(-2.6,-4.907) 25(-2.2,-4.907) 26(-1.8,-4.907) 27(-1.4,-4.907) 28(-1,-4.907) 29(-0.6,-4.907) 30(-0.2,-4.907) 31(0.2,-4.907) 32(0.6,-4.907) 33(1,-4.907) 34(1.4,-4.907) 35(1.8,-4.907) 36(2.2,-4.907) 37(2.6,-4.907) 38(3,-4.907) 39(3.4,-4.907) 40(3.8,-4.907) 61(3.8,4.907) 62(3.4,4.907) 63(3,4.907) 64(2.6,4.907) 65(2.2,4.907) 66(1.8,4.907) 67(1.4,4.907) 68(1,4.907) 69(0.6,4.907) 70(0.2,4.907) 71(-0.2,4.907) 72(-0.6,4.907) 73(-1,4.907) 74(-1.4,4.907) 75(-1.8,4.907) 76(-2.2,4.907) 77(-2.6,4.907) 78(-3,4.907) 79(-3.4,4.907) 80(-3.8,4.907)
  rect 3.4x3.4 smd: 81(0,0)
R0402
  rect 0.566x0.54 smd: 1(-0.433,0) 2(0.433,0)
R0805
  rect 1.133x1.377 smd: 1(-1,0) 2(1,0)
SENSOR-SMD_LTR-390UV-01
  rect 0.3x0.4 smd: 1(-0.65,-0.775) 2(0,-0.775) 3(0.65,-0.775) 4(0.65,0.775) 5(0,0.775) 6(-0.65,0.775)
SMT wire pad (2)
  rect 2.54x1.524 smd: 1(0,0)
  rrect 2.54x1.524 smd: 2(0,-2.54)
SOD-323_L1.8-W1.3-LS2.5-RD
  rect 1x0.75 smd: 1(-1.173,0) 2(1.173,0)
SOT-23-3_L2.9-W1.6-P1.90-LS2.8-BR
  rect 1.07x0.6 smd: 1(1.235,-0.95) 2(1.235,0.95) 3(-1.235,0)
SOT-23-6_L2.9-W1.6-P0.95-LS2.8-BR
  rect 1.1x0.6 smd: 1(1.35,-0.95) 2(1.35,0) 3(1.35,0.95) 4(-1.35,0.95) 5(-1.35,0) 6(-1.35,-0.95)
SW-SMD_4P-L5.1-W5.1-P3.70-LS6.5-TL_H1.5
  rect 1x0.75 smd: 1(-3,1.875) 2(3,1.875) 3(-3,-1.875) 4(3,-1.875)
TF-SMD_TF-01A
  rect 0.6x1.3 smd: 1(2.3,5.276) 2(1.2,5.276) 3(0.101,5.276) 4(-1,5.276) 5(-2.099,5.276) 6(-3.2,5.276) 7(-4.3,5.276) 8(-5.399,5.276) 9(-6.5,5.276)
  rect 1.2x1.4 smd: 10(-7.599,4.426) 13(7.08,4.426)
  rect 1.2x2 smd: 11(-7.76,-5.276) 12(7.76,-5.276)
TSOT-23-5_L2.9-W1.6-P0.95-LS2.8-BR
  rect 1.1x0.7 smd: 1(1.294,-0.951) 2(1.294,-0.001) 3(1.294,0.951) 4(-1.294,0.951) 5(-1.294,-0.949)
UDFN-16_L3.3-W1.4-P0.40-BL-EP
  rect 0.2x0.4 smd: 1(-1.4,-0.6) 2(-1,-0.6) 3(-0.6,-0.6) 4(-0.2,-0.6) 5(0.2,-0.6) 6(0.6,-0.6) 7(1,-0.6) 8(1.4,-0.6) 9(1.4,0.6) 10(1,0.6) 11(0.6,0.6) 12(0.2,0.6) 13(-0.2,0.6) 14(-0.6,0.6) 15(-1,0.6) 16(-1.4,0.6)
  rect 2.8x0.4 smd: 17(0,0)
UQFN-10_L2.0-W1.5-P0.50-BL-EP
  rect 0.3x0.58 smd: 1(-0.748,-0.64) 4(0.752,-0.64) 6(0.752,0.64) 9(-0.748,0.64)
  rect 0.25x0.58 smd: 2(-0.248,-0.64) 3(0.252,-0.64) 7(0.252,0.64) 8(-0.248,0.64)
  rect 0.63x0.35 smd: 5(0.86,0) 10(-0.86,-0.002)
USB-C-SMD_GT-USB-9014AB
  oval 1x1.8 hole 0.6x1.4: 0(-5.55,1.35) 0(5.55,1.35)
  oval 1x2.2 hole 0.6x1.8: 0(-5.55,-2.55) 0(5.55,-2.55)
  rect 0.6x1.2 smd: A1B12(-3.2,2.55) A4B9(-2.4,2.55) B1A12(3.2,2.55) B4A9(2.4,2.55)
  rect 0.3x1.2 smd: A5(-1.25,2.55) A6(-0.25,2.55) A7(0.25,2.55) A8(1.25,2.55) B5(1.75,2.55) B6(0.75,2.55) B7(-0.75,2.55) B8(-1.75,2.55)
VSON-6_L1.5-W1.5-P0.50-TL
  rect 0.6x0.25 smd: 1(-0.575,0.5) 2(-0.575,0) 3(-0.575,-0.5)
  rect 1x0.25 smd: 4(0.575,-0.5) 5(0.575,0) 6(0.575,0.5)
VSON-8_L3.0-W3.0-P0.65-TL-EP
  rect 0.85x0.34 smd: 1(-1.476,0.975) 2(-1.476,0.325) 3(-1.476,-0.325) 4(-1.476,-0.976) 5(1.476,-0.976) 6(1.476,-0.325) 7(1.476,0.325) 8(1.476,0.976)
  custom 1.52x3.42 smd: 9(0,-0.005)
WQFN-24_L4.0-W4.0-P0.50-TL-EP2.6
  rect 0.85x0.25 smd: 1(-2.025,1.25) 2(-2.025,0.75) 3(-2.025,0.25) 4(-2.025,-0.25) 5(-2.025,-0.75) 6(-2.025,-1.25) 13(2.025,-1.25) 14(2.025,-0.75) 15(2.025,-0.25) 16(2.025,0.25) 17(2.025,0.75) 18(2.025,1.25)
  rect 0.25x0.85 smd: 7(-1.25,-2.025) 8(-0.75,-2.025) 9(-0.25,-2.025) 10(0.25,-2.025) 11(0.75,-2.025) 12(1.25,-2.025) 19(1.25,2.025) 20(0.75,2.025) 21(0.25,2.025) 22(-0.25,2.025) 23(-0.75,2.025) 24(-1.25,2.025)
  rect 2.6x2.6 smd: 25(0.001,0)

## Nets
As in the schematic, except:
GND: 3V3.4 5V.2 AMP.7 AMP.9 AUDIO.7 AUDIO.12 AUDIO.17 AUDIO.28 AUDIO.33 AVR.3 AVR.25 BATT.1 BATT.2 C81.1 C82.1 C95.1 C96.1 C107.1 C108.1 C109.1 C110.1 C111.1 C112.1 C114.1 C115.1 C116.1 C117.1 C118.1 C132.1 C153.2 C154.2 C167.1 C191.1 C192.1 C201.2 C202.2 C203.2 C204.2 C208.1 C209.1 C210.1 C211.1 C212.1 C213.1 C214.1 C215.1 C216.1 C218.1 C219.1 C220.1 C221.1 C224.1 C225.1 C228.1 C229.1 C232.1 C233.1 C234.1 C235.1 C236.1 C237.2 C238.2 C239.1 C244.1 C245.1 C246.1 C247.1 C248.1 C249.1 DE-POP.1 DE-POP1.1 DEBUG.3 DISPLAY.1 DISPLAY.2 DISPLAY.3 DISPLAY.4 DISPLAY.25 DISPLAY.36 GND.1 GND.2 GND.3 GND1.1 GND1.2 GND1.3 GND2.1 GND2.2 GND2.3 H2.12 H7.1 ILIM.2 L15.17 L18.2 L19.2 microSD.6 microSD.10 microSD.11 microSD.12 microSD.13 PWR.17 PWR.18 PWR.25 Q6.2 Q9.2 R48.2 R54.2 R55.2 R57.2 R58.2 R104.1 R110.2 R111.2 R113.2 R115.1 R116.1 R119.2 R120.2 R121.2 R122.2 R130.1 RADIO.3 RADIO.6 RADIO.12 RADIO.21 RGB.1 RP2350B.62 RP2350B.81 TV1.2 U26.1 U26.6 U26.7 U33.2 U39.2 U39.4 U40.3 U41.3 U42.2 U43.9 U43.11 U43.18 U43.20 U43.25 USB4.0 USB4.A1B12 USB4.B1A12 VDD.4

Pads without a net: 3V3 2; AMP 2; DISPLAY 27 28 37 38 39 40 41 42; H4 1 2; H5 1 2; H6 1 2; HEADSET 5 6; L15 1 8 9 16; PWR 4; RADIO 1 15 16 20; TV1 1 3; U26 4 10 11; U41 2 5; U42 4; U43 1 2 3 4 5 6 7 14 15 16 17 19 21; USB4 A8 B8; VDD 2

## Via types
v1: diameter 0.5, hole 0.3, Top Layer to Bottom Layer, 627 vias

## Routing (per net, layer and track width the routed paths; a pad name or vN(x,y) marks a point on that pad's centre or on a via; arc(x,y) is an arc through that point)
3V3: length 59
  Top Layer w0.15: 44.7,26.13 44.7,27.33 45,27.33 v1(45.6,27.93) ; U26.12 43.7,37.43 44.7,36.43 U26.5
  Top Layer w0.2: U43.22 28.68,33.91 v1(29,34.23) ; v1(27.8,27.73) 27.8,28.48 C249.2 27.75,29.28 28.28,29.81 U43.8 ; v1(32.2,31.23) C247.2 32.15,30.33 31.4,30.33 31.03,30.7 U43.13
  Top Layer w0.25: 45.35,39.73 45.35,39.18 44.85,38.68 U26.8 ; U40.8 38.59,50.68 ; U26.5 46.65,36.43 C95.2 ; AVR.4 49.05,42.54 C118.2 ; C235.2 44.54,50.93 45,50.93 45.65,51.58 U41.1
  Top Layer w0.3: U33.5 56.1,43.13 55.15,44.08 U33.1
  Top Layer w0.5: 32.4,42.33 31.9,42.83 R45.2 31.9,46.4 3V1.1 31.77,46.53 R130.2 ; 32.4,42.33 v1(42,42.33) ; 32.4,42.33 31.9,41.83 R46.2 R129.2 R128.2 ; v1(49.3,41.43) 49.3,42.18 C118.2 ; C234.2 38.6,50.68 v1(38.6,49.93) ; v1(52.6,43.93) 53.4,43.93 53.55,44.08 U33.1 ; v1(45.3,40.43) 45.3,39.79 45.35,39.73 ; C95.2 v1(46.7,35.53) ; C235.2 v1(44.3,49.83)
  Bottom Layer w0.15: v1(45.6,27.93) 45.6,32.93 v1(45.2,33.33)
  vias: v1(45.2,34.13) v1(46,34.13) v1(46,33.33)
5V: length 48.1
  Top Layer w0.25: U33.6 57.45,44.08 58.65,42.88 v1(60.95,42.88)
  Top Layer w0.5: 5V.1 51.95,20.78 C82.2 52.1,20.33 ; 97.9,75.13 93.3,75.13 89.8,71.63 v1(89.8,68.63) ; 52.1,20.33 v1(52.5,19.93) v1(51.7,19.93) 52.1,20.33
  Bottom Layer w0.5: v1(71.1,49.53) 89.8,68.23 v1(89.8,68.63)
5V_ON: length 40.4
  Top Layer w0.15: 5V_EN.1 54.95,24.13 51.2,24.13 50.35,23.28 5V.3 50.3,22.63 v1(49,22.63) ; R48.1 44.7,43.56 v1(44.7,44.03) ; AVR.21 45.95,46.18 45.7,46.43 45.1,46.43 44.7,46.03 v1(44.7,45.83)
  Bottom Layer w0.15: v1(49,22.63) 43.3,28.33 43.3,38.03 44,38.73 44,42.93 44.7,43.63 v1(44.7,44.03) v1(44.7,45.83)
DVDD: length 15
  Top Layer w0.2: 28.6,84.79 28.6,84.63 v1(29.2,84.03) 29.4,83.83 RP2350B.32 ; C115.2 v1(37.3,76.43) 37.1,76.43 37,76.53 RP2350B.10 ; RP2350B.65 27.8,69.63 27.5,69.33 27.2,69.33 ; C114.2 22.4,75.83 v1(22.8,76.23) 23.1,76.53 RP2350B.51
  Top Layer w0.25: 27.5,67.63 27.2,67.93 27.2,69.33
  vias: v1(27.6,69.33) v1(27.6,68.73)
GND: length 198.2
  Top Layer w0.15: U26.6 U26.7 45.24,37.77 v1(45.7,38.23) ; R55.2 70.47,66.7 v1(70.5,66.73) ; R111.2 v1(30.3,13.13) ; v1(50.9,40.53) 50.33,40.53 50.3,40.56 ; v1(70.9,99.33) L15.17 v1(70.9,94.93) ; U43.25 29.48,31.1 U43.11 ; U43.25 28.68,31.5 U43.9 ; U43.25 29.48,32.3 U43.20 ; DISPLAY.25 62.25,80.98 v1(62.6,81.33) ; DISPLAY.36 58.55,86.48 v1(58,87.03) ; v1(17.7,17.13) 17.73,17.16 R113.2 ; v1(44.1,30.33) 44.07,30.31 3V3.4 ; U26.1 43.35,34.88 v1(43.8,34.43) ; U40.3 42.25,51.18 v1(42.4,51.33) ; v1(43.3,5.53) DE-POP1.1 ; v1(30.3,17.83) 30.3,17.03
  Top Layer w0.2: RP2350B.62 26.6,71.42 26.31,71.13 25.9,71.13 ; 29.8,34.13 29.48,33.81 U43.20 ; 19.4,4 19.6,3.8 v1(19.6,3.13) ; U43.18 31.03,32.7 31.4,32.33 ; v1(20.8,3.13) R57.2 ; v1(27.8,85.93) 28.34,85.93 28.4,85.88
  Top Layer w0.25: C154.2 27.9,87.69 v1(27.9,88.13) ; AUDIO.17 73.75,36.48 v1(74.4,37.13) ; v1(19.8,76.83) C110.1 ; U39.2 29.15,90.63 v1(28,90.63) ; AVR.3 48.55,45.68 AVR.25 ; 75.25,38.58 AUDIO.12 69.15,38.58 69,38.73 ; 75.25,38.58 74.25,39.58 AUDIO.7 ; 75.25,38.58 75.75,38.08 AUDIO.28 ; v1(75.5,4.33) 75.82,4.65 75.82,5.24 ; v1(74.6,3.33) 74.82,3.11 RADIO.3 ; v1(22.9,82.93) C111.1 ; U39.4 31.45,88.83 v1(32.8,88.83) ; VDD.4 55.07,37.11 C229.1 ; v1(19.8,75.83) C114.1 ; v1(39.7,71.53) 39.65,71.53 39.54,71.64 39.54,71.69 C107.1 ; v1(40.2,78.93) C112.1 ; C232.1 57.8,48.73 v1(58.8,48.73) ; v1(21.9,70.43) 21.9,71.29 ; 25.75,20.03 PWR.17 PWR.18 25.25,20.53 25.75,20.03 ; 25.75,20.03 PWR.25 ; C109.1 35.4,84.29 v1(35.4,85.03) ; C167.1 29.25,67.53 v1(30,67.53) ; 31,85.98 31.06,86.03 v1(31.8,86.03) ; v1(40.1,76.43) C115.1 ; v1(71.3,42.33) C209.1 ; U41.3 v1(45.3,50.28) ; v1(33.1,87.23) C153.2 ; v1(35.4,67.43) C108.1 ; v1(58.79,50.44) 57.89,50.44 C233.1
  Top Layer w0.3: AMP.9 82.62,19.9 AMP.7 82.62,17.81 82.84,17.59 C208.1 82.84,16.19 v1(82.9,16.13) ; microSD.12 95.64,98.53 v1(94.1,98.53) ; v1(87.4,97.83) 87.38,97.81 microSD.13 ; v1(25.3,70.33) C211.1 ; microSD.11 95.64,82.93 v1(94.1,82.93) ; v1(58.4,70.53) 58.45,70.48 DISPLAY.4 DISPLAY.3 DISPLAY.2 DISPLAY.1 ; v1(87.4,83.13) microSD.10 ; v1(25.3,69.33) C212.1 ; v1(77,2.03) 77,2.33 76.74,2.59 76.32,2.59
  Top Layer w0.4: C192.1 81,38.93 v1(81.3,39.23) ; v1(81,40.43) 80.04,40.43 C203.2 ; C204.2 82,38.63 v1(82.6,39.23)
  Top Layer w0.5: v1(45,29.63) 45,30.03 C228.1 46.1,30.13 v1(46.1,29.63) ; 24.4,24.73 24.4,24.53 ; 24.4,24.73 v1(23.7,24.73) ; 24.4,24.73 v1(24.4,25.53) ; v1(76.6,29.93) C244.1 ; v1(83.6,87.53) 84.9,87.53 ; L19.2 v1(82.1,6.33) ; v1(63.5,10.63) DE-POP.1 ; v1(80.8,88.63) 80.8,89.83 ; C224.1 40.66,29.23 v1(39.8,29.23) ; v1(63.3,6.23) L18.2 ; v1(68.1,17.83) R122.2 ; ILIM.2 v1(32.8,27.53) ; v1(46.1,42.13) 45.3,42.13 ; C81.1 v1(45,22.43) ; v1(83.8,67.23) 83.8,68.22 ; C246.1 82.7,62.13 v1(81.4,63.43) ; v1(77.4,17.63) R121.2 ; TV1.2 v1(4.3,22.23) ; v1(20.3,17.53) 20.9,18.13 21,18.13 ; v1(81.5,71.63) C245.1 ; C118.1 50.4,42.19 v1(50.4,41.43) ; v1(78.9,13.23) C238.2 ; R115.1 41.7,27.3 v1(41.7,26.53) ; v1(21.2,15.63) 21.2,16.53 ; v1(36.59,50.74) 36.6,50.73 37.3,50.73 ; 37.5,51.73 36.8,51.73 v1(36.79,51.74) ; v1(18.3,19.03) 18.3,18.33 ; v1(56.5,37.73) 55.7,37.73 C229.1 56.1,36.93 v1(56.5,36.93) ; v1(53.1,43.13) 54.1,43.13 ; v1(66.9,28.23) R104.1 ; v1(26.3,25.53) 26.3,24.73 ; 26.3,24.73 26.3,24.63 ; 26.3,24.73 26.2,24.73 ; 26.3,24.73 v1(27.1,24.73) ; v1(46.7,38.53) 46.7,37.63 ; v1(81.8,35.13) C202.2 ; v1(42.2,48.33) 41.4,48.33 ; v1(66.7,70.13) 66.7,69.42 Q6.2 ; 75.3,8.23 v1(75.3,7.53) 75.3,6.83 ; v1(44.1,52.63) 44.3,52.43 44.3,51.83 ; v1(80.8,90.83) 80.8,89.93 ; v1(75,29.93) C201.2 ; v1(46.4,40.43) 46.4,39.83 ; v1(50.9,34.13) 51.6,34.13 ; v1(52.1,23.33) C82.1 ; C191.1 C192.1 ; v1(49.5,21.73) 5V.2 ; v1(71.5,13.23) C239.1 ; v1(50.7,35.13) 50.7,36.13 ; v1(50.4,32.53) 50.4,33.23
  Inner1 w0.5: 83,45.93 83,44.83 ; 83,44.83 83.7,45.53 ; 83,44.83 82.3,45.53 82.3,45.63 ; 83,44.83 83,44.13 ; 83,44.13 83.7,43.43 ; 83,44.13 82.3,43.43 82.3,43.33 ; 83,44.13 83,43.13
  Bottom Layer w0.3: 48,15.13 47.9,15.03 47.9,14.43 47.15,13.68 ; 60.7,37.23 62.4,37.23 ; 41.3,3.33 43.9,3.33 ; 87.3,39.73 87.2,39.83 85.6,39.83 ; 85.5,3.33 87.7,3.33 ; 85.7,15.83 87.8,15.83 ; 57.6,18.73 59.4,18.73 ; 63,42.13 64.4,40.73 ; 44.7,14.63 46,13.33 ; 60.5,33.03 61.5,32.03 ; 85.6,37.03 v1(88,37.03) ; 56.7,17.23 57.7,16.23 ; 41.3,8.33 44,8.33 ; 85.5,20.53 87.6,20.53 ; 58.9,31.43 59.9,30.43 ; 57.7,28.83 59.4,28.83 ; 57.6,20.63 59.5,20.63 ; 43.1,12.93 44.3,11.73 ; 61.3,40.23 62.5,39.03 ; 55.3,15.73 56.2,14.83 ; 60.7,34.63 62.4,34.63 ; 57.6,24.13 59.4,24.13 ; 85.4,6.73 87.8,6.73 ; 85.3,24.33 87.7,24.33 ; 85.5,11.03 87.9,11.03
  vias: v1(1,99.03) v1(1,95.03) v1(1,91.03) v1(1,87.03) v1(1,69.03) v1(1,57.03) v1(1,53.03) v1(1,49.03) v1(1,45.03) v1(1,41.03) v1(1,37.03) v1(1,33.03) v1(1,29.03) v1(1,17.03) v1(1,13.03) v1(1,9.03) v1(1,5.03) v1(1,1.03) v1(3,71.53) v1(3.8,32.43) v1(4,19.63) v1(4,11.33) v1(4.1,73.23) v1(4.1,27.43) v1(4.1,6.13) v1(4.2,38.43) v1(5,99.03) v1(5.3,39.83) v1(5.4,1.03) v1(5.7,74.43) v1(5.9,27.43) v1(5.9,24.43) v1(5.9,19.63) v1(5.9,11.43) v1(5.9,5.93) v1(6.1,32.33) v1(6.5,37.83) v1(6.6,35.13) v1(7.5,67.03) v1(7.6,32.73) v1(7.8,19.63) v1(7.8,11.43) v1(8.2,85.83) v1(8.2,82.73) v1(8.9,68.43) v1(9,99.03) v1(9.4,37.83) v1(10.2,69.73) v1(11.1,63.53) v1(11.4,1.13) v1(11.5,36.63) v1(11.6,43.93) v1(11.9,47.43) v1(11.9,32.03) v1(12.4,64.83) v1(13,99.03) v1(13.2,36.63) v1(13.5,47.33) v1(13.5,32.03) v1(13.6,66.23) v1(13.6,43.83) v1(14.3,39.33) v1(14.9,35.73) v1(15.9,43.03) v1(16,85.83) v1(16,82.63) v1(16,75.73) v1(16.1,1.03) v1(16.3,50.33) v1(16.7,57.93) v1(17,99.03) v1(17,73.73) v1(18,96.63) v1(18.9,47.53) v1(19,44.73) v1(19.9,72.83) v1(20,57.33) v1(20,35.63) v1(20.1,8.93) v1(20.7,1.03) v1(20.8,59.13) v1(21.5,44.73) v1(22.8,65.63) v1(23.1,15.23) v1(23.2,71.33) v1(25,8.53) v1(25.3,81.43) v1(25.6,20.13) v1(25.6,18.53) v1(26,46.53) v1(26.2,55.23) v1(26.2,42.33) v1(26.2,11.13) v1(26.5,33.93) v1(27.1,45.03) v1(27.3,18.53) v1(27.4,20.13) v1(27.6,52.03) v1(28,62.23) v1(28.3,32.23) v1(28.3,31.13) v1(28.6,78.13) v1(28.6,76.73) v1(28.6,75.33) v1(28.9,50.43) v1(28.9,14.13) v1(29.4,32.23) v1(29.4,31.13) v1(30,78.13) v1(30,76.73) v1(30,75.33) v1(30,39.63) v1(30.3,45.03) v1(30.5,63.83) v1(31.1,11.63) v1(31.3,22.63) v1(31.4,78.13) v1(31.4,76.73) v1(31.4,75.33) v1(31.9,52.13) v1(32.1,66.63) v1(32.2,8.53) v1(32.8,90.73) v1(32.9,8.93) v1(34.2,46.03) v1(34.2,34.43) v1(34.6,64.83) v1(34.8,88.53) v1(35.1,26.43) v1(35.9,39.83) v1(36.5,47.53) v1(36.5,37.13) v1(36.5,32.13) v1(37.2,85.33) v1(37.2,62.93) v1(38.6,65.83) v1(38.7,95.93) v1(38.8,82.63) v1(38.8,48.03) v1(39.7,61.13) v1(39.8,37.23) v1(40,16.33) v1(40.4,69.03) v1(40.4,34.63) v1(40.5,32.03) v1(40.7,44.33) v1(41,13.03) v1(41,9.03) v1(41,5.03) v1(41,1.03) v1(41.1,40.33) v1(41.8,73.33) v1(43.2,82.63) v1(44.1,1.13) v1(44.2,8.33) v1(44.4,11.63) v1(46.1,13.33) v1(46.5,63.33) v1(47,11.13) v1(48,46.73) v1(48,45.13) v1(48.8,68.53) v1(49.4,24.23) v1(49.6,46.73) v1(49.6,45.13) v1(49.7,94.23) v1(49.9,12.93) v1(50,1.13) v1(50.2,51.03) v1(50.9,99.33) v1(51.2,58.93) v1(52.9,57.73) v1(54.9,89.93) v1(54.9,72.03) v1(56.6,61.43) v1(57.3,29.73) v1(57.6,14.63) v1(58.1,66.83) v1(58.3,99.33) v1(58.4,69.03) v1(58.7,62.03) v1(58.7,32.83) v1(59,0.93) v1(59.5,41.33) v1(59.9,24.03) v1(60,17.43) v1(60.4,62.63) v1(60.6,91.13) v1(60.8,82.33) v1(61.6,40.73) v1(62.2,23.83) v1(62.4,63.23) v1(63.3,38.33) v1(64.5,63.83) v1(64.9,0.93) v1(65.3,99.33) v1(65.3,3.93) v1(66,93.73) v1(66.3,64.43) v1(67.1,22.23) v1(67.2,24.23) v1(68.1,41.23) v1(68.1,35.43) v1(68.3,31.83) v1(69.6,43.53) v1(69.8,26.93) v1(70.1,94.23) v1(70.1,63.23) v1(70.7,36.33) v1(70.9,2.93) v1(71.6,94.23) v1(71.8,8.03) v1(72.4,45.93) v1(72.6,26.93) v1(72.6,19.93) v1(73.2,1.03) v1(73.8,56.43) v1(74.4,39.53) v1(74.6,4.33) v1(74.8,13.03) v1(75.5,3.33) v1(76.4,24.93) v1(76.7,39.63) v1(76.75,37.08) v1(77.3,14.73) v1(77.7,85.83) v1(79,99.03) v1(79,25.43) v1(79.1,6.63) v1(79.4,20.73) v1(79.4,19.63) v1(79.7,67.93) v1(80.2,3.43) v1(81.6,52.03) v1(81.6,41.53) v1(82,83.73) v1(82,81.73) v1(82,79.73) v1(82,77.73) v1(82,74.93) v1(82.2,32.13) v1(82.5,26.93) v1(82.9,46.53) v1(83,99.03) v1(83.8,76.23) v1(83.9,15.53) v1(84.1,94.73) v1(84.6,74.43) v1(84.7,20.83) v1(84.7,19.73) v1(84.7,5.13) v1(84.8,1.13) v1(85.1,36.53) v1(85.1,10.43) v1(85.6,18.73) v1(85.8,68.03) v1(86.4,73.13) v1(87.1,56.23) v1(87.4,69.53) v1(87.6,38.83) v1(87.7,53.63) v1(87.7,47.93) v1(87.8,86.13) v1(88,33.03) v1(88,29.03) v1(88,25.03) v1(88,21.03) v1(88,17.03) v1(88,13.03) v1(88,9.03) v1(88,5.03) v1(88,1.03) v1(88.7,42.53) v1(89.3,40.93) v1(90.1,36.33) v1(90.7,74.53) v1(90.8,56.23) v1(90.8,53.63) v1(90.8,47.93) v1(91,99.03) v1(91,1.03) v1(91.2,69.53) v1(93.2,37.03) v1(94,74.23) v1(94.5,40.83) v1(95,1.03) v1(95.4,76.43) v1(96.3,42.13) v1(96.4,38.33) v1(99,99.03) v1(99,95.03) v1(99,91.03) v1(99,87.03) v1(99,49.83) v1(99,1.03) v1(99.1,72.53) v1(99.1,69.03) v1(99.1,62.73) v1(99.1,56.43) v1(99.2,38.33)
V3_LDO: length 7.9
  Top Layer w0.5: V3_EN.1 89.17,62.13 C246.2 84.75,62.18 84.75,65.64
VCC: length 10.6
  Top Layer w0.15: 42.5,30.23 42.5,29.13
  Top Layer w0.5: v1(48.5,21.73) 5V.5 46.8,21.73 46.1,21.03 C81.2
  Top Layer w0.7: 21.87,25.73 21.9,25.7 L17.2 22.25,23.13 C219.2 C220.2
  vias: v1(27.3,23.33) v1(27.3,22.53) v1(28.1,23.33) v1(28.1,22.53) v1(28.9,23.33) v1(28.9,22.53) v1(39.2,30.73) v1(39.2,30.03) v1(39.9,30.73) v1(39.9,30.03) v1(49.2,37.63) v1(49.2,36.93) v1(49.9,37.63) v1(49.9,36.93)
VDD_EN: length 36.5
  Top Layer w0.15: U40.5 41,52.23 41.5,52.73 v1(41.8,52.73) ; AVR.5 49.55,43.18 49.7,43.03 v1(50.6,43.03) ; VDD_EN.1 57.68,41.11 v1(51.52,41.11) ; U40.1 41.64,49.99 v1(42.2,49.43) 43.4,48.23 v1(46.4,48.23) ; 52.5,35.93 52,35.93 51.8,36.13 v1(51.8,36.33)
  Bottom Layer w0.15: v1(51.8,36.33) 51.8,40.83 v1(51.52,41.11) 50.6,42.03 v1(50.6,43.03) 50.6,44.93 47.3,48.23 v1(46.4,48.23) ; v1(42.2,49.43) 41.8,49.83 v1(41.8,52.73)
ACCEL_INT: length 34.8
  Top Layer w0.15: U26.9 44.35,39.18 ; R129.1 34,38.43 ; U43.12 30.26,30.27 v1(30.9,29.63) ; 34.5,38.43 35.3,38.43 v1(35.7,38.03) 36.1,38.43 ACCEL_INT.1 42.1,38.43 42.9,39.23 44.4,39.23 v1(44.6,39.43) ; AVR.22 45.85,45.68 45.7,45.83 v1(45.4,45.83)
  Bottom Layer w0.15: v1(30.9,29.63) 31.4,29.13 35,29.13 35.7,29.83 v1(35.7,38.03) ; v1(44.6,39.43) 44.6,42.53 45.4,43.33 v1(45.4,45.83)
AUDIO_INT: length 62.6
  Top Layer w0.15: AUDIO.11 69.85,39.08 68.8,40.13 68.8,44.63 69.7,45.53 69.7,48.13 68.8,49.03 68.8,52.73 67.1,54.43 50.5,54.43 46.5,58.43 46.5,60.83 38.9,68.43 38.9,69.43 35.8,72.53 35.8,72.83 35.3,73.33 RP2350B.2
AUDIO_MICBIAS: length 12.6
  Top Layer w0.15: AUDIO.19 74.75,33.98 v1(75.2,33.53) ; R123.2 v1(69.5,31.93) 69.5,31.33 68.4,30.23 R103.2
  Bottom Layer w0.15: v1(69.5,31.93) 70.5,32.93 74.6,32.93 v1(75.2,33.53)
AUDIO_RESET: length 11.3
  Top Layer w0.15: AUDIO.31 78.45,39.58 78.8,39.93 78.8,41.43 79.3,41.93 80.8,41.93 82.2,43.33 ARESET.1
AVR_INT: length 43.9
  Top Layer w0.15: AVR_INT.1 39.2,46.23 41.5,46.23 v1(42.2,46.93) 43.9,46.93 44,47.03 45.8,47.03 46.15,46.68 AVR.20 ; v1(35.1,71.43) 34.71,71.82 RP2350B.80
  Bottom Layer w0.15: v1(42.2,46.93) 39.4,49.73 39.4,53.98 37.75,55.63 37.75,68.78 v1(35.1,71.43)
AVR_TX: length 57.5
  Top Layer w0.15: AVR.24 43.15,44.68 42.8,45.03 36.6,45.03 v1(26.9,54.73)
  Bottom Layer w0.15: v1(26.9,54.73) 21.3,54.73 1.6,74.43
BTN_1: length 47.7
  Top Layer w0.15: D17.2 D9.2 60.3,49.03 v1(58.7,47.43) 58.45,47.18 50.82,47.18
  Top Layer w0.2: D5.2 50.8,16.43 v1(51.7,17.33)
  Bottom Layer w0.15: v1(51.7,17.33) 53.7,19.33 53.7,42.43 v1(58.7,47.43)
BTN_2: length 49.3
  Top Layer w0.15: 50.82,45.68 61.18,45.68 D14.2 D10.2
  Top Layer w0.2: v1(50,16.73) 49.3,16.73 49.1,16.53 D6.2
  Bottom Layer w0.15: v1(59.7,45.73) 58.8,45.73 54.9,41.83 54.9,18.23 53.4,16.73 v1(50,16.73)
BTN_3: length 52.3
  Top Layer w0.15: D11.2 52.5,15.63 51.6,14.73 48.3,14.73 47.4,15.63 D7.2 ; 50.82,46.18 59.15,46.18 v1(60.3,47.33) D15.2
  Top Layer w0.2: 52.5,15.96 53.8,17.26 v1(53.8,18.23)
  Bottom Layer w0.15: v1(53.8,18.23) 54.3,18.73 54.3,42.13 59.5,47.33 v1(60.3,47.33)
BTN_4: length 38.8
  Top Layer w0.15: AVR.6 50.62,43.91 v1(52.7,41.83)
  Top Layer w0.2: D8.2 45.7,16.63 45.4,16.93 v1(44.8,16.93) 44.3,16.93 44,16.63 D12.2
  Bottom Layer w0.15: v1(44.8,16.93) 45.5,17.63 51.1,17.63 53.1,19.63 53.1,41.43 v1(52.7,41.83)
BTN_ABXY: length 237.5
  Top Layer w0.15: 2.5,4.43 3.8,4.43 v1(4.9,5.53) 6,4.43 8.5,4.43 ; v1(96.3,40.83) 96.3,39.83 ; 96.3,39.83 97.1,39.03 97.1,24.23 96.2,23.33 ; 96.3,39.83 89.2,39.83 ; 96.2,23.33 97.8,21.73 97.8,4.03 97.3,3.53 96.4,3.53 ; 96.2,23.33 89.3,23.33 ; 50.82,45.18 58.75,45.18 59.1,44.83 v1(60.1,44.83) ; v1(33.9,30.53) 33.9,29.73 v1(39.3,24.33) ; 96.5,3.63 90.6,3.63 90.5,3.53
  Bottom Layer w0.15: v1(39.3,24.33) 40.8,22.83 40.8,19.53 44.7,15.63 54,15.63 v1(54.8,16.43) 55.5,17.13 55.5,41.53 58.8,44.83 v1(60.1,44.83) 63.9,44.83 65.3,46.23 70.6,46.23 72.9,43.93 82.6,43.93 84.8,41.73 95.4,41.73 v1(96.3,40.83) ; v1(4.9,5.53) 4.9,32.23 10.6,37.93 26.5,37.93 v1(33.9,30.53)
BTN_CTRL: length 79.6
  Top Layer w0.15: 92.4,66.83 92.5,66.83 ; 92.5,66.83 92.5,64.73 ; 92.5,66.83 92.6,66.93 98.5,66.93 ; 92.5,66.83 92.5,67.03 ; 92.5,64.73 92.7,64.53 98.5,64.53 ; 92.5,64.73 92.5,64.43 ; v1(83.2,58.33) 98.6,58.33 ; v1(89.2,64.53) 92.4,64.53 ; 50.82,46.68 58.75,46.68 60.2,48.13 v1(62.4,48.13)
  Bottom Layer w0.15: v1(89.2,64.53) 88.7,64.53 83.2,59.03 v1(83.2,58.33) 82.4,58.33 72.2,48.13 v1(62.4,48.13)
BTN_DPAD: length 68.9
  Top Layer w0.15: AVR.19 46.45,47.18 46,47.63 41.8,47.63 v1(41.2,47.03) ; 15.6,45.03 v1(14.1,45.03) 8.3,45.03 7.2,43.93 7.2,35.23 8.3,34.13 15.6,34.13 15.7,34.23 ; 18.3,36.63 v1(18.3,43.93)
  Bottom Layer w0.15: v1(14.1,45.03) 14.1,44.63 14.8,43.93 v1(18.3,43.93) 31.8,43.93 32,44.13 35,44.13 37.9,47.03 v1(41.2,47.03)
DB_0: length 79.6
  Top Layer w0.15: H2.3 74.41,85.83 68.1,85.83 62.75,80.48 DISPLAY.24 59.57,80.53 58.6,80.53 46.3,92.83 37.3,92.83 35.4,94.73 25.4,94.73 23,92.33 23,85.73 21.1,83.83 21.1,80.3 22.07,79.33 RP2350B.44
DB_1: length 74.8
  Top Layer w0.15: RP2350B.43 22.23,79.73 21.5,80.46 21.5,83.43 23.6,85.53 23.6,92.13 25.8,94.33 35,94.33 37.1,92.23 46.1,92.23 58.35,79.98 DISPLAY.23 63.15,79.98 67.8,84.63 73.15,84.63 H1.9
DB_2: length 76.1
  Top Layer w0.15: RP2350B.42 22.4,80.13 21.9,80.63 21.9,83.03 24.2,85.33 24.2,91.93 26.2,93.93 34.6,93.93 36.9,91.63 45.9,91.63 58.05,79.48 DISPLAY.22 63.55,79.48 67.4,83.33 74.45,83.33 H2.4
DB_3: length 67.1
  Top Layer w0.15: H1.8 73.19,82.03 67,82.03 63.95,78.98 DISPLAY.21 57.75,78.98 45.7,91.03 36.7,91.03 34.2,93.53 26.6,93.53 24.8,91.73 24.8,83.53 26.2,82.13 RP2350B.40
DB_4: length 68.9
  Top Layer w0.15: RP2350B.39 26.6,82.3 25.4,83.5 25.4,91.53 27,93.13 33.8,93.13 36.5,90.43 45.5,90.43 57.45,78.48 DISPLAY.20 64.35,78.48 66.6,80.73 74.39,80.73 H2.5
DB_5: length 64.7
  Top Layer w0.15: RP2350B.38 27,82.46 26,83.46 26,91.33 27.4,92.73 33.4,92.73 36.3,89.83 45.3,89.83 57.15,77.98 DISPLAY.19 64.75,77.98 66.3,79.53 73.17,79.53 H1.7
DB_6: length 66.4
  Top Layer w0.15: H2.6 74.43,78.23 66,78.23 65.25,77.48 DISPLAY.18 56.85,77.48 45.1,89.23 36.1,89.23 33,92.33 27.8,92.33 26.6,91.13 26.6,83.43 27.4,82.63 RP2350B.37
DB_7: length 62.2
  Top Layer w0.15: H1.6 73.18,76.98 DISPLAY.17 56.55,76.98 45,88.53 36,88.53 32.6,91.93 28.2,91.93 27.2,90.93 27.2,83.39 27.8,82.79 RP2350B.36
DB_8: length 54.2
  Top Layer w0.15: RP2350B.28 31,83.43 32.1,84.53 32.1,85.13 34.8,87.83 44.9,87.83 56.25,76.48 DISPLAY.16 68.65,76.48 69.4,75.73 74.47,75.73 H2.7
DB_9: length 50.7
  Top Layer w0.15: RP2350B.27 31.4,83.23 32.5,84.33 32.5,84.93 34.8,87.23 44.7,87.23 55.95,75.98 DISPLAY.15 68.25,75.98 69.8,74.43 73.19,74.43 H1.5
DB_10: length 53.2
  Top Layer w0.15: RP2350B.26 31.8,83.03 32.9,84.13 32.9,84.76 34.77,86.63 44.5,86.63 55.65,75.48 DISPLAY.14 67.85,75.48 70.1,73.23 74.51,73.23 H2.8
DB_11: length 49.8
  Top Layer w0.15: H1.4 73.15,71.83 70.6,71.83 67.45,74.98 DISPLAY.13 55.35,74.98 44.3,86.03 34.73,86.03 33.3,84.6 33.3,83.93 32.2,82.83 RP2350B.25
DB_12: length 51.4
  Top Layer w0.15: RP2350B.23 33,82.43 33.9,83.33 36.22,83.33 38.32,85.43 44.1,85.43 55.05,74.48 DISPLAY.12 67.05,74.48 70.9,70.63 74.45,70.63 H2.9
DB_13: length 47.9
  Top Layer w0.15: RP2350B.22 33.4,82.23 34.1,82.93 36.39,82.93 38.29,84.83 43.9,84.83 54.75,73.98 DISPLAY.11 66.65,73.98 71.29,69.34 H1.3
DB_14: length 50.5
  Top Layer w0.15: H2.10 74.39,68.03 71.7,68.03 66.25,73.48 DISPLAY.10 54.45,73.48 43.7,84.23 38.25,84.23 36.55,82.53 34.3,82.53 33.8,82.03 RP2350B.21
DB_15: length 46.5
  Top Layer w0.15: RP2350B.20 35.4,80.53 38.4,83.53 43.6,83.53 54.15,72.98 DISPLAY.9 65.85,72.98 72.03,66.8 H1.2
DISP_CSX: length 83.4
  Top Layer w0.15: H2.1 74.33,90.83 69.5,90.83 63.15,84.48 DISPLAY.32 57.05,84.48 46.9,94.63 37.9,94.63 36.6,95.93 24.2,95.93 21.2,92.93 21.2,86.33 19.9,85.03 19.9,79.56 21.33,78.13 RP2350B.47
DISP_DCX: length 78.6
  Top Layer w0.15: RP2350B.46 21.5,78.53 20.3,79.73 20.3,84.63 21.8,86.13 21.8,92.73 24.6,95.53 36.2,95.53 37.7,94.03 46.7,94.03 56.75,83.98 DISPLAY.31 63.55,83.98 69.23,89.66 H1.11
DISP_LED_K: length 23
  Top Layer w0.3: 62.22,71.48 61.72,70.98 DISPLAY.5 ; 62.22,71.48 DISPLAY.6 ; 62.22,71.48 62.27,71.53 61.82,71.98 DISPLAY.7
  Top Layer w0.5: R84.1 v1(62.3,70.03)
  Bottom Layer w0.5: v1(62.3,70.03) 68.07,64.26 H1.1
DISP_RDX: length 43.2
  Top Layer w0.15: v1(41.1,76.13) 40.7,75.73 37.2,75.73 36.8,76.13 RP2350B.9 ; v1(57.5,82.63) 58,82.63 58.35,82.98 DISPLAY.29 64.35,82.98 68.5,87.13 73.19,87.13 H1.10
  Bottom Layer w0.15: v1(41.1,76.13) 47.6,82.63 v1(57.5,82.63)
DISP_TE: length 82.1
  Top Layer w0.15: RP2350B.48 21.17,77.73 19.5,79.4 19.5,85.43 20.6,86.53 20.6,93.13 23.8,96.33 37,96.33 38.1,95.23 47.1,95.23 57.35,84.98 DISPLAY.33 62.75,84.98 69.97,92.2 H1.12
DISP_WRX: length 79.8
  Top Layer w0.15: RP2350B.45 21.8,78.93 20.7,80.03 20.7,84.23 22.4,85.93 22.4,92.53 25,95.13 35.8,95.13 37.5,93.43 46.5,93.43 56.45,83.48 DISPLAY.30 63.95,83.48 68.8,88.33 74.37,88.33 H2.2
EMBEDDED_ANTENNA: length 9.7
  Top Layer w0.15: RADIO.4 75.32,1.41 76,0.73 78,0.73 78.75,1.49 FMA.1 81.66,1.49 82.2,2.03 82.2,2.86 L19.1
GPIO_10: length 56.3
  Top Layer w0.15: RP2350B.8 36.6,75.73 37.2,75.13 v1(41.6,75.13)
  Bottom Layer w0.15: GPIO_10.1 88.48,77.01 87.2,75.73 71.9,75.73 71.3,75.13 v1(41.6,75.13)
GPIO_12: length 32.6
  Top Layer w0.15: RP2350B.11 41.4,76.93 49.8,68.53 49.8,65.83 54,61.63 55.18,61.63 H8.2
GPIO_13: length 36.1
  Top Layer w0.15: H8.3 57.12,62.23 54.2,62.23 50.4,66.03 50.4,69.63 42.4,77.63 41.8,77.63 41.5,77.33 RP2350B.12
GPIO_14: length 39.1
  Top Layer w0.15: RP2350B.13 41,77.73 41.6,78.33 42.6,78.33 51,69.93 51,66.23 54.4,62.83 59.06,62.83 H8.4
GPIO_15: length 42.1
  Top Layer w0.15: RP2350B.14 40.5,78.13 41.4,79.03 42.8,79.03 51.6,70.23 51.6,66.43 54.6,63.43 61,63.43 H8.5
GPIO_16: length 44.9
  Top Layer w0.15: H8.6 68.44,58.59 63,64.03 54.8,64.03 52.2,66.63 52.2,70.53 43.1,79.63 37.4,79.63 36.7,78.93 RP2350B.16
GPIO_17: length 47.9
  Top Layer w0.15: H8.7 70.98,58.55 64.9,64.63 55,64.63 52.8,66.83 52.8,70.83 43.3,80.33 37.5,80.33 36.5,79.33 RP2350B.17
GPIO_18: length 50.9
  Top Layer w0.15: H8.8 73.52,58.61 66.9,65.23 55.2,65.23 53.4,67.03 53.4,71.13 43.5,81.03 37.6,81.03 36.3,79.73 RP2350B.18
GPIO_19: length 53.9
  Top Layer w0.15: H8.9 68.76,65.83 55.4,65.83 54,67.23 54,71.43 43.7,81.73 37.5,81.73 35.9,80.13 RP2350B.19
GPIO_46: length 20.4
  Top Layer w0.15: RP2350B.57 24.4,74.13 23.5,73.23 21.1,73.23 20.8,72.93 20.8,68.93 23.74,65.99 H7.9
GPIO_47: length 17.1
  Top Layer w0.15: 23.74,72.83 23.74,72.87 24.6,73.73 RP2350B.58
  Bottom Layer w0.15: H7.8 23.8,61.01 v1(23.8,72.83)
HEADSET_ANTENNA: length 3.8
  Top Layer w0.15: RADIO.2 74.32,1.95 74.1,1.73 C242.2
HEADSET_DETECT: length 80.7
  Top Layer w0.15: v1(72.3,40.73) 73.72,40.73 AUDIO.8 ; v1(75.8,26.93) 78.1,29.23 C207.2 ; v1(71.2,37.33) 70.2,37.33 69.5,36.63 R123.1 ; 50,2.83 46.5,2.83 45.6,3.73 v1(45.6,11.33) ; v1(61.2,24.33) 61.7,24.83 v1(68.8,24.83)
  Bottom Layer w0.15: 75.8,31.73 75.8,35.43 75.3,35.93 72.6,35.93 v1(71.2,37.33) 71.2,39.63 v1(72.3,40.73) ; 75.8,31.73 75.74,31.73 ; 75.8,31.73 v1(75.8,26.93) 73.7,24.83 v1(68.8,24.83) ; v1(61.2,24.33) 61.2,17.13 57.9,13.83 48.1,13.83 v1(45.6,11.33)
HEADSET_LEFT: length 28.8
  Top Layer w0.25: C199.2 64.5,22.03 65.7,23.23 v1(68.1,23.23) ; AUDIO.25 78.05,36.58 v1(78.6,36.03)
  Bottom Layer w0.25: v1(78.6,36.03) 78.6,35.03 78,34.43 78,24.53 76.7,23.23 v1(68.1,23.23)
HEADSET_MIC: length 4.9
  Top Layer w0.15: AUDIO.21 75.75,34.78 78.1,32.43 C207.1
HEADSET_RIGHT: length 32.2
  Top Layer w0.25: v1(66.7,19.93) 65.7,18.93 C200.2 ; AUDIO.27 78.75,37.58 v1(78.8,37.53)
  Bottom Layer w0.25: v1(78.8,37.53) 79,37.53 79.9,36.63 79.9,24.43 77.2,21.73 68.5,21.73 v1(66.7,19.93)
I2C_SCL: length 82
  Top Layer w0.15: I2C_SCL.1 38.16,43.63 v1(35.6,43.63) R45.1 ; v1(42.4,50.43) 42.15,50.68 U40.2 ; 38.9,43.63 42.4,43.63 v1(42.8,44.03) v1(44,44.03) ; v1(31,42.33) 28.28,39.61 U43.23 ; v1(41.97,36.97) 42.92,36.97 U26.13 ; PWR.5 27.25,16.48 v1(27.7,16.03) ; 48.55,47.96 48.55,49.68 47.95,50.28 U41.4 47.05,50.28 46.4,49.63 v1(46.1,49.63)
  Bottom Layer w0.15: v1(41.97,36.97) 42,37 ; 42,37 42,29.83 33.6,21.43 33.6,20.33 29.3,16.03 v1(27.7,16.03) ; 42,37 42,38.53 42.8,39.33 v1(42.8,44.03) 42.8,50.03 v1(42.4,50.43) ; v1(46.1,49.63) 45.1,49.63 44,48.53 v1(44,44.03) ; v1(35.6,43.63) 32.3,43.63 v1(31,42.33)
I2C_SCL_VDD: length 121.5
  Top Layer w0.15: RADIO.7 77.54,3.09 v1(77.7,2.93) ; v1(67,44.23) 67,51.83 66.2,52.63 49.6,52.63 48.1,54.13 44.5,54.13 v1(43.4,55.23) 42.9,55.73 42.9,60.43 36.8,66.53 36.8,67.83 34.1,70.53 33.4,70.53 33,70.93 RP2350B.78 ; v1(69.8,40.33) v1(70.7,41.23) 71.85,40.08 AUDIO.9 ; 41,49.23 U40.10
  Bottom Layer w0.15: v1(67,44.23) 68.6,42.63 69.3,42.63 v1(70.7,41.23) ; v1(77.7,2.93) 77.5,2.73 72.8,2.73 67.4,8.13 67.4,11.23 63.1,15.53 63.1,33.63 v1(69.8,40.33) ; v1(43.4,55.23) 41.1,52.93 41.1,49.33 v1(41,49.23)
I2C_SDA: length 81.8
  Top Layer w0.15: v1(42.7,35.63) 42.7,36.33 42.8,36.43 U26.14 ; U40.4 41.85,51.68 42.3,52.13 v1(42.4,52.13) ; 49.05,47.96 49.05,50.78 48.25,51.58 U41.6 47.03,52.23 v1(46.1,52.23) ; v1(28.4,15.43) 28.4,16.33 27.75,16.98 PWR.6 ; v1(43.4,41.03) 38.31,41.03 I2C_SDA.1 38.15,40.93 v1(35.1,40.93) R46.1 ; v1(28.7,40.93) 27.88,40.11 U43.24
  Bottom Layer w0.15: 43.4,51.13 44.5,52.23 v1(46.1,52.23) ; 43.4,51.13 v1(42.4,52.13) ; 43.4,51.13 v1(43.4,41.03) 43.4,39.03 42.7,38.33 v1(42.7,35.63) 42.7,29.63 34.2,21.13 34.2,20.03 29.6,15.43 v1(28.4,15.43) ; v1(28.7,40.93) v1(35.1,40.93)
I2C_SDA_VDD: length 117.9
  Top Layer w0.15: AUDIO.10 71.45,39.58 v1(70.7,40.33) ; 42.6,53.93 43.1,53.43 47.9,53.43 49.3,52.03 65.9,52.03 66.4,51.53 v1(66.4,43.53) ; 42.6,53.93 42.6,60.13 36.3,66.43 36.3,67.73 34,70.03 33.2,70.03 32.6,70.63 RP2350B.77 ; 42.6,53.93 42.1,53.43 41.1,53.43 40.36,52.69 U40.6 40.4,51.72 ; RADIO.8 77.96,3.59 v1(78.2,3.83)
  Bottom Layer w0.15: v1(78.2,3.83) 77.2,4.83 71.6,4.83 68.9,7.53 68.9,12.43 SDA_VDD.1 63.8,17.53 63.8,33.43 v1(70.7,40.33) 69,42.03 67.9,42.03 v1(66.4,43.53)
I2S_BCK: length 56.9
  Top Layer w0.15: AUDIO.2 76.75,41.68 79,43.93 BCK.1 79,49.73 71.9,56.83 51.7,56.83 48.5,60.03 48.5,67.63 R136.2
I2S_DIN: length 53.2
  Top Layer w0.15: R134.2 47.5,64.43 47.5,59.23 51.1,55.63 70.7,55.63 75.8,50.53 DIN.1 75.75,47.88 75.75,40.88 ; AUDIO.4 75.75,40.88 ; 75.75,40.88 75.7,40.93 ; 75.75,40.88 75.8,40.83
I2S_DOUT: length 59.9
  Top Layer w0.15: AUDIO.5 75.25,42.08 74.2,43.13 DOUT.1 74.2,48.33 67.5,55.03 50.8,55.03 47,58.83 47,61.23 39.5,68.73 39.5,69.63 36.3,72.83 36.3,73.13 35.7,73.73 RP2350B.3
I2S_LRCK: length 51
  Top Layer w0.15: R135.2 48,66.03 48,59.63 51.4,56.23 71.3,56.23 77.4,50.13 LRCK.1 77.4,43.23 76.25,42.08 AUDIO.3
IOVDD: length 162.2
  Top Layer w0.15: 82.85,68.22 82.85,69.38 83.36,69.89 84.75,69.89 ; DISPLAY.35 60.55,85.98 v1(61.4,86.83) ; v1(70.8,43.33) 70.8,46.73 R131.2 ; DISPLAY.34 61.55,85.48 v1(62.1,86.03) ; v1(35.6,56.23) QSPI_PULLUP.2 ; 54.7,32.93 54.6,33.03 54.6,34.13 ; 54.7,34.13 v1(56.3,34.13)
  Top Layer w0.2: C108.2 33.4,69.43 33.1,69.43 32.2,70.33 RP2350B.76 32.2,73.03 ; 31,84.89 31,84.13 30.6,83.73 RP2350B.29 30.6,80.03 ; RP2350B.59 26.1,73.33 ; 29.4,73.13 RP2350B.69 29.4,69.63 29.2,69.43 ; 29,73.13 RP2350B.68 29,69.63 29.2,69.43 ; 29.2,69.43 C167.2 ; 27.15,70.33 27.15,70.78 27.4,71.03 RP2350B.64 27.4,73.13 ; 33.6,78.53 RP2350B.15 37.2,78.53 37.6,78.93 C112.2 ; C110.2 21.94,76.93 RP2350B.50 26.1,76.93 ; C111.2 23.25,80.53 RP2350B.41 26,80.53 ; 34.16,84.23 34.16,84.19 32.6,82.63 RP2350B.24 32.6,80.13 ; 23.37,69.33 23.2,69.16 v1(23.2,68.43) ; 38.21,73.02 37.9,73.33 37.2,73.33 36,74.53 RP2350B.5 33.5,74.53 ; RP2350B.35 28.2,79.83 ; 26.1,72.93 RP2350B.60 24.7,72.93 24,72.23 22.05,72.23 C116.2
  Top Layer w0.25: AUDIO.6 74.75,41.58 74,42.33 C209.2 73.1,42.09 v1(73.1,41.53) ; C192.2 C191.2 79.94,36.93 78.6,36.93 78.45,37.08 AUDIO.26 ; C192.2 C204.1 ; C192.2 v1(81,36.03) ; 76.25,8.13 76.44,8.13 ; 76.44,8.13 76.52,8.13 ; 76.44,8.13 C237.1 76.52,8.15 76.52,8.13 ; 76.52,8.13 v1(76.52,7.55) 76.52,6.91 76.5,6.88 ; 76.52,8.13 77,8.13 77.4,7.73 77.4,5.03 76.96,4.59 RADIO.10 ; 76.5,6.88 76.5,6.88 76.5,6.03 76.32,5.85 76.32,5.09 ; 76.5,6.88 C236.2 76.44,6.93 76.5,6.88 ; v1(79.1,39.33) 78.85,39.08 AUDIO.30
  Top Layer w0.3: DISPLAY.8 57.95,72.48 v1(57,71.53) ; v1(81.7,16.13) 81.75,16.19 C208.2 81.75,17.59 81.97,17.81 AMP.6
  Top Layer w0.5: 82.3,89.63 v1(82.3,88.43) 82.3,87.23 ; U42.1 84.75,71.58 C245.2 84.8,73.03 84.1,73.73 v1(78.1,73.73) ; v1(57.1,35.43) 59.23,35.43 IOVDD.1 ; v1(52.1,31.23) v1(52.1,30.53) 52.1,30.03 51.7,29.63 50.3,29.63 50.3,27.13 ; 85.1,89.73 C132.2
  Inner2 w0.5: 46,60.03 46.16,59.87 46.16,57.53 ; 46.16,57.53 46.5,57.87 ; 46.16,57.53 46.7,57.53 ; 46.16,57.53 45.86,57.23 ; 46.5,57.87 46.5,58.53 ; 46.5,57.87 47.26,58.63 47.3,58.63 ; 46.7,57.53 48.1,57.53 ; 46.7,57.53 47.1,57.93 ; 45.36,56.73 45.86,57.23 ; 45.36,56.73 44.86,56.23 ; 45.36,56.73 48.5,56.73 ; 45.86,57.23 48.2,57.23 ; v1(35.6,56.23) 44.86,56.23 ; 44.86,56.23 49.7,56.23
  Inner2 w1.5: 78.1,50.83 84.3,50.83 85.7,49.43 AVCC.3 ; AVCC.2 84.4,45.73 81.9,43.23 79.4,43.23
  vias: v1(33.8,80.43) v1(33.8,79.83) v1(33.8,79.23) v1(33.8,73.53) v1(33.8,72.93) v1(56.5,40.13) v1(56.5,39.43) v1(56.5,38.73) v1(57.2,40.13) v1(57.2,39.43) v1(57.2,38.73)
